# EAGLE schematic PinHeck (EAGLE 7.4.0), part 1 of 2
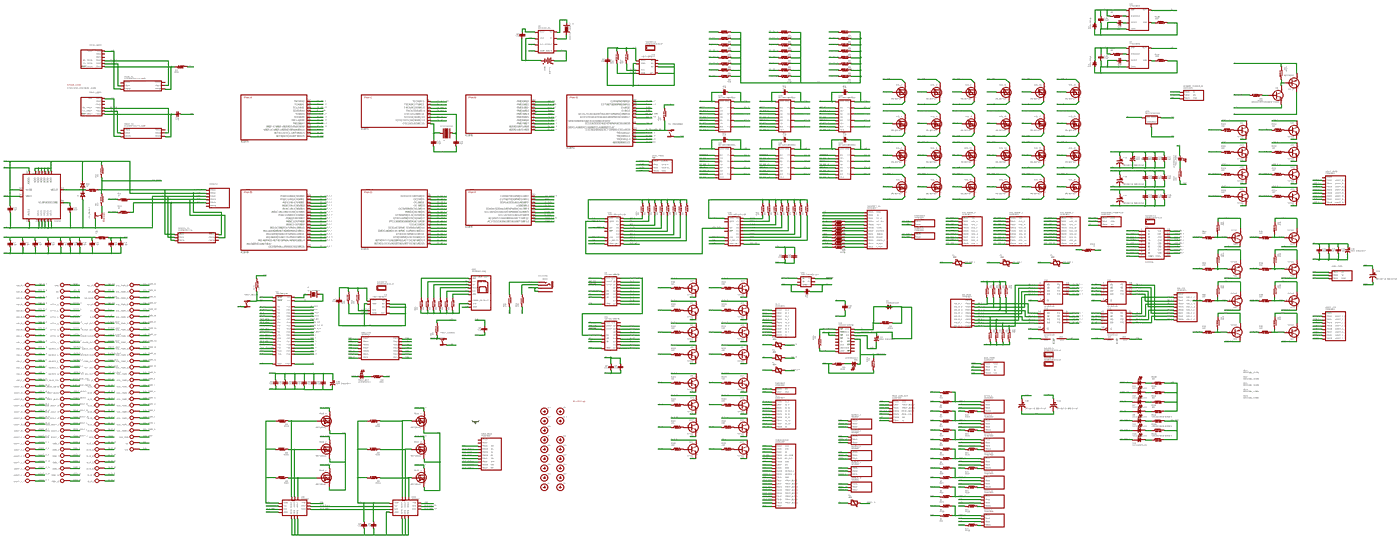
[diagram p0: schematic, sheet 1, overview]
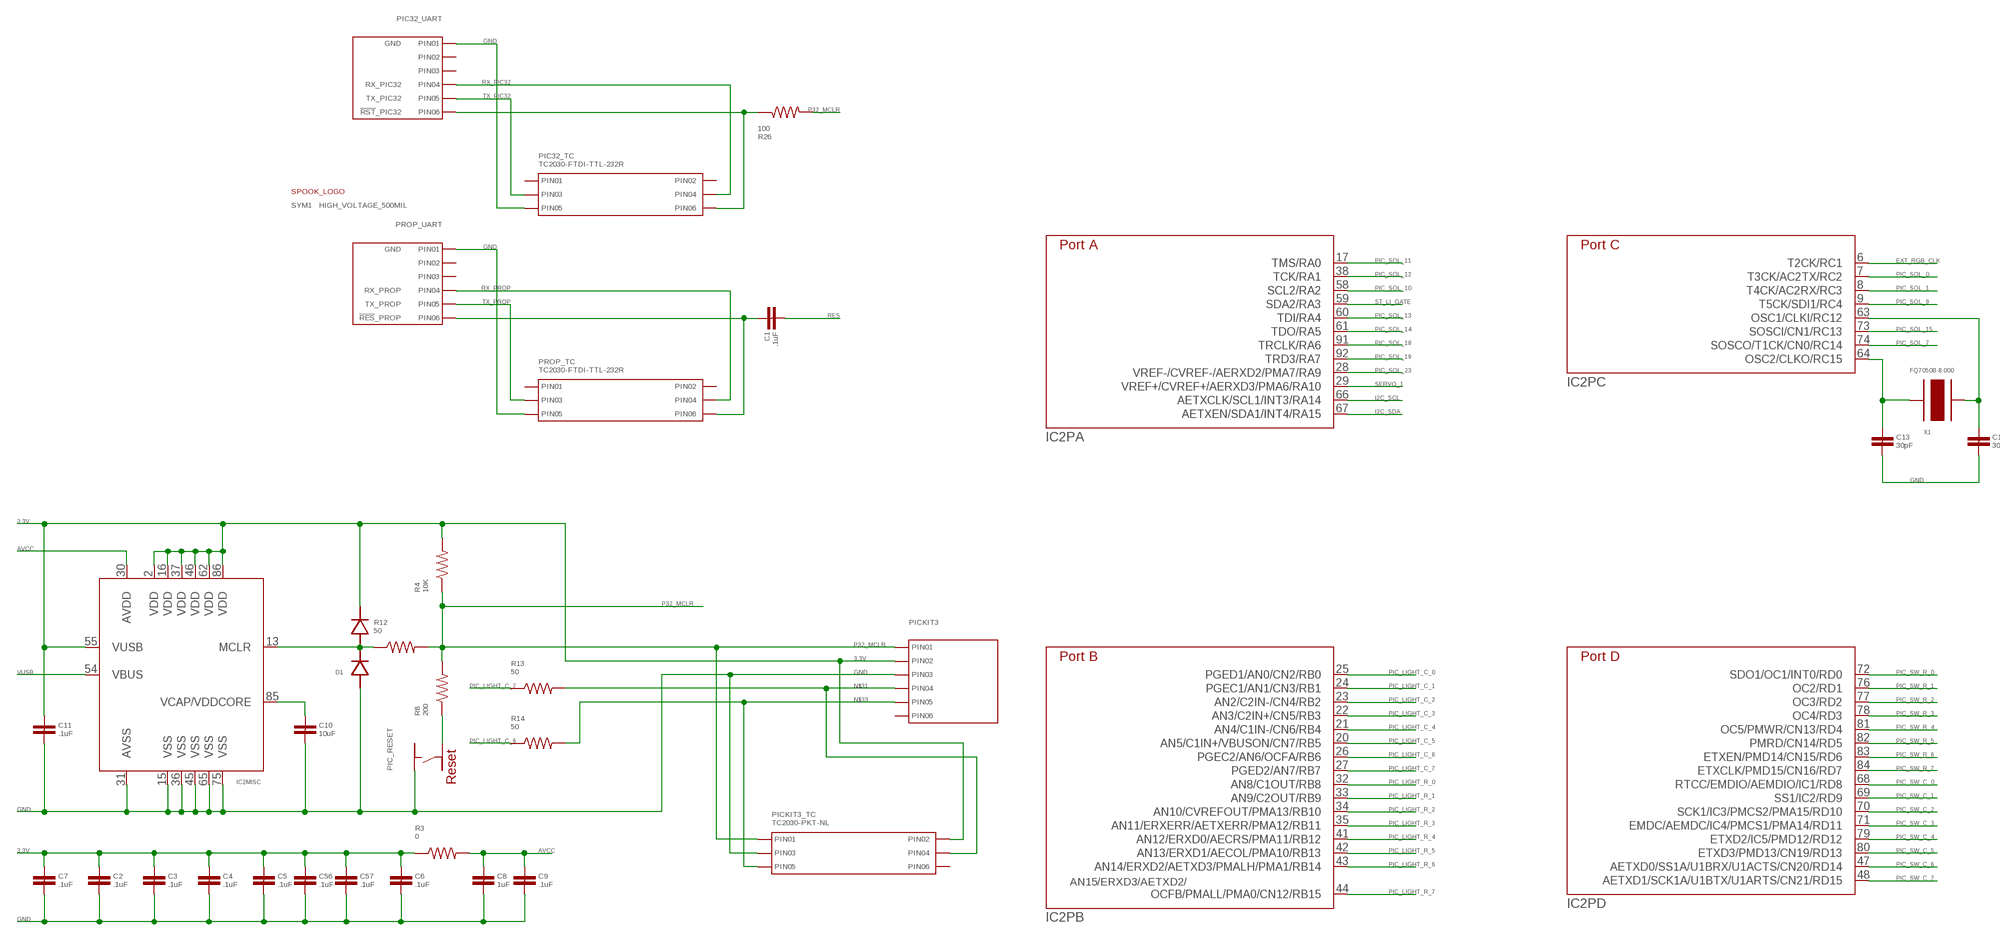
[diagram p1: schematic, sheet 1, part 1 of 7]
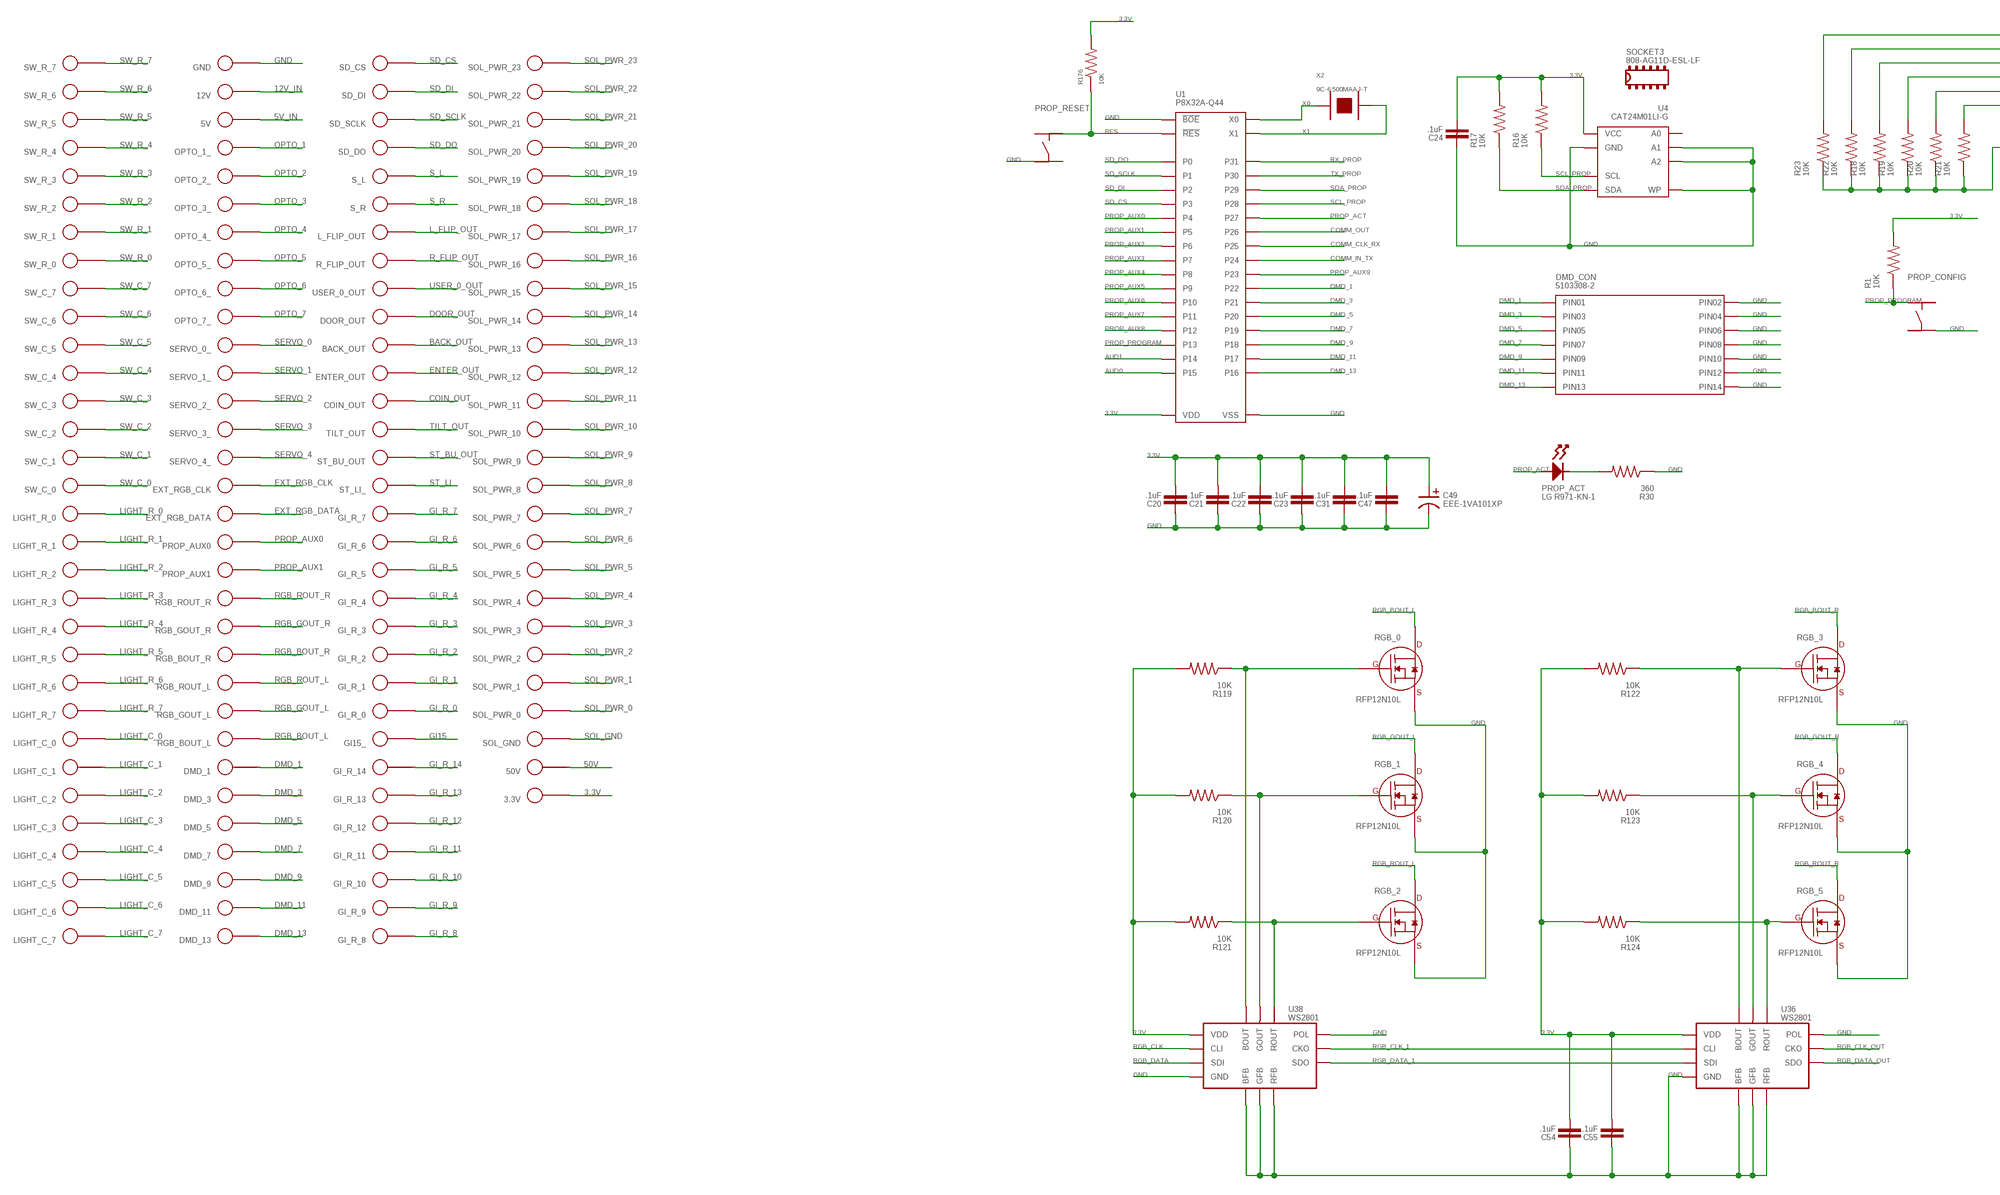
[diagram p2: schematic, sheet 1, part 2 of 7]
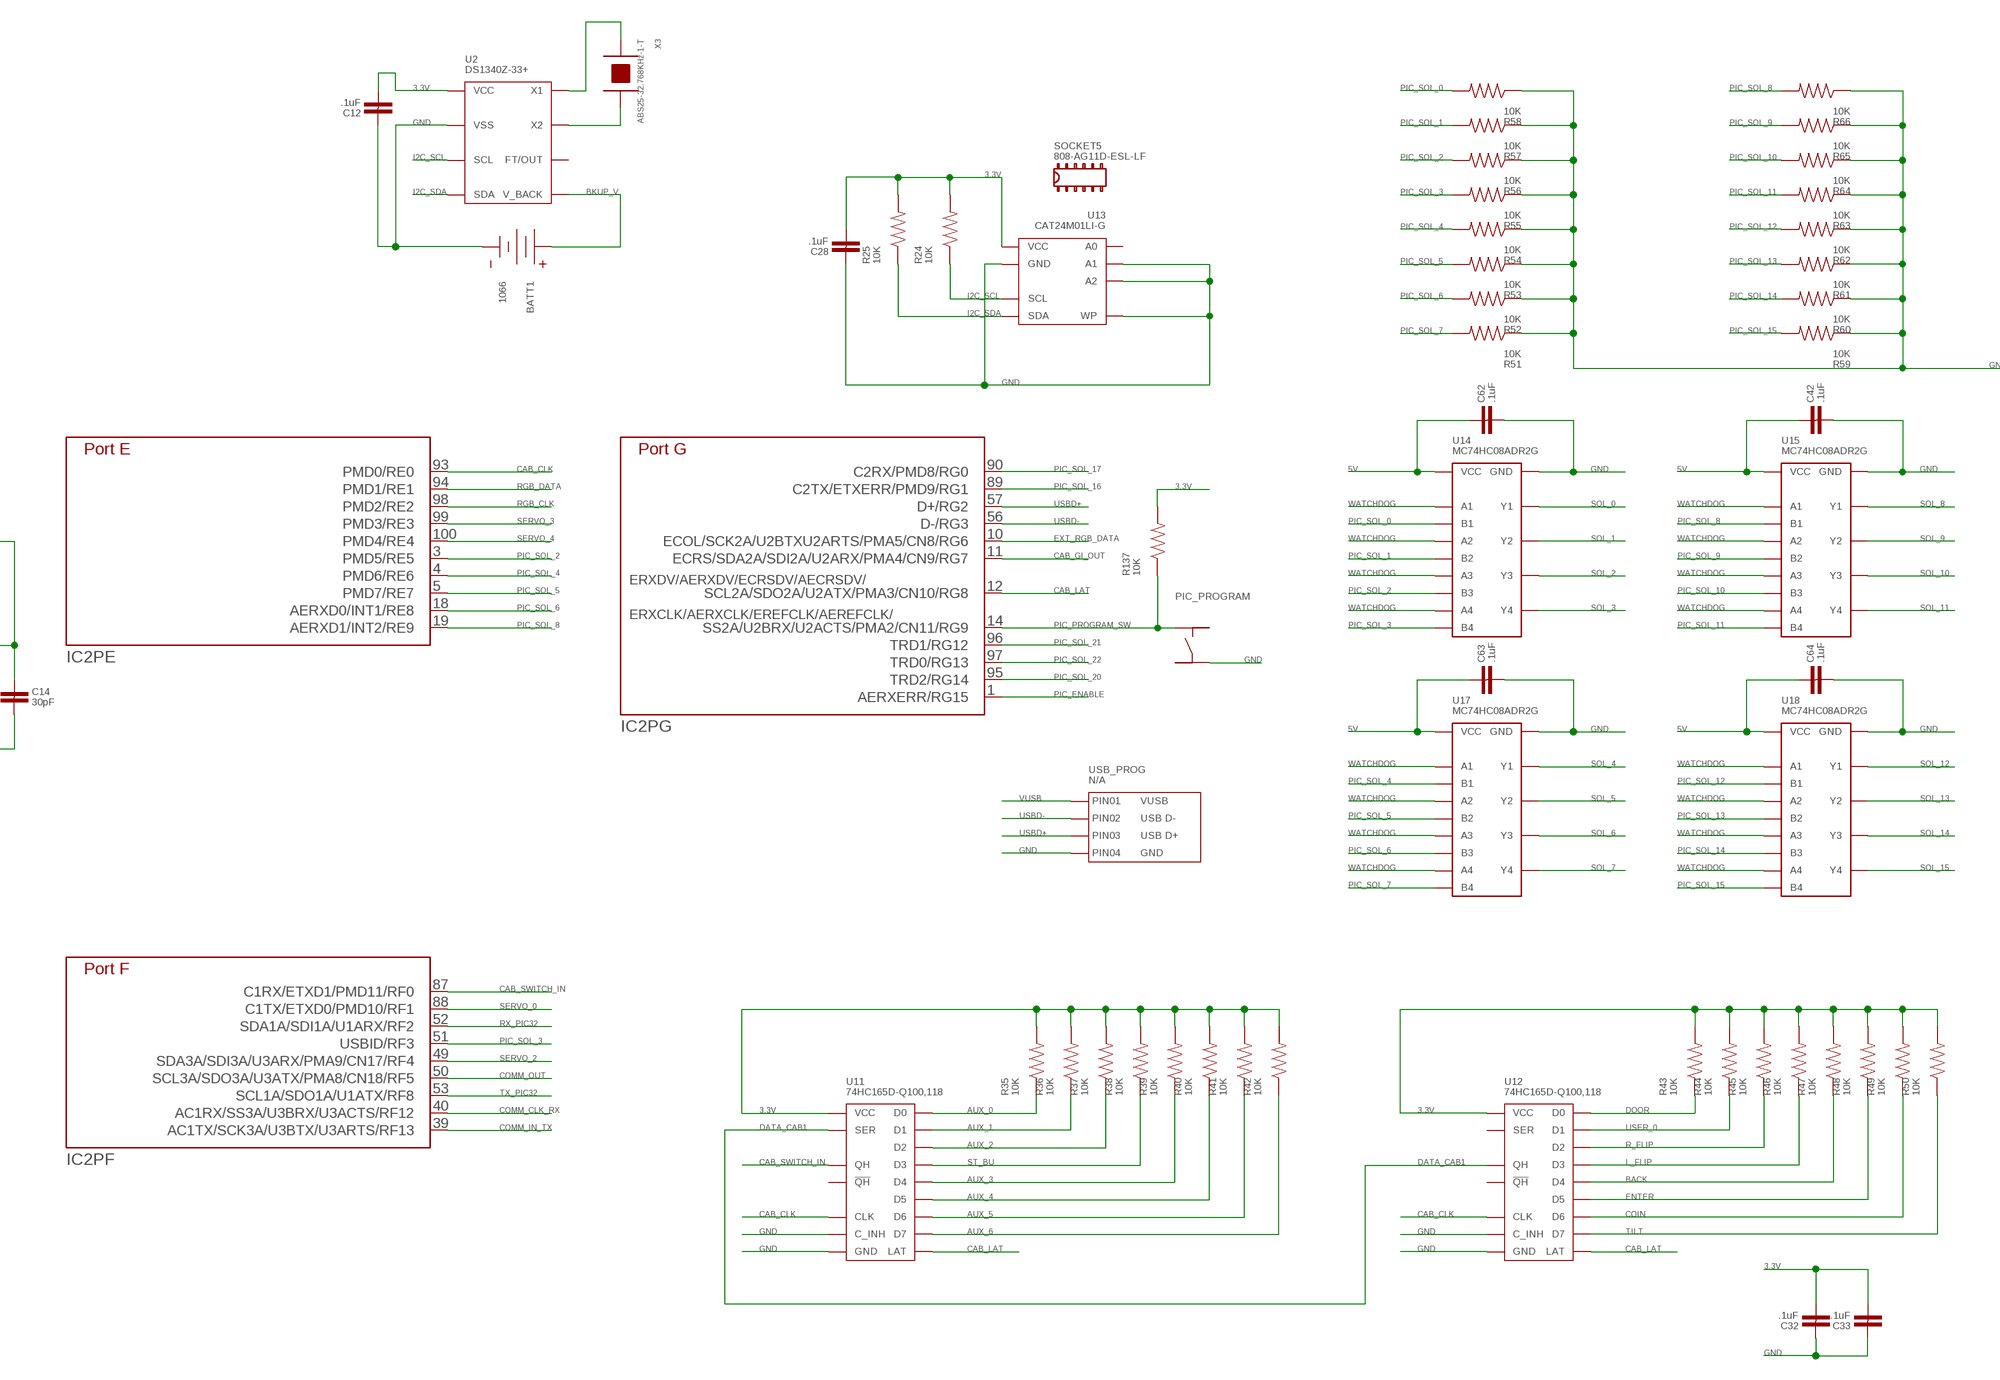
[diagram p3: schematic, sheet 1, part 3 of 7]
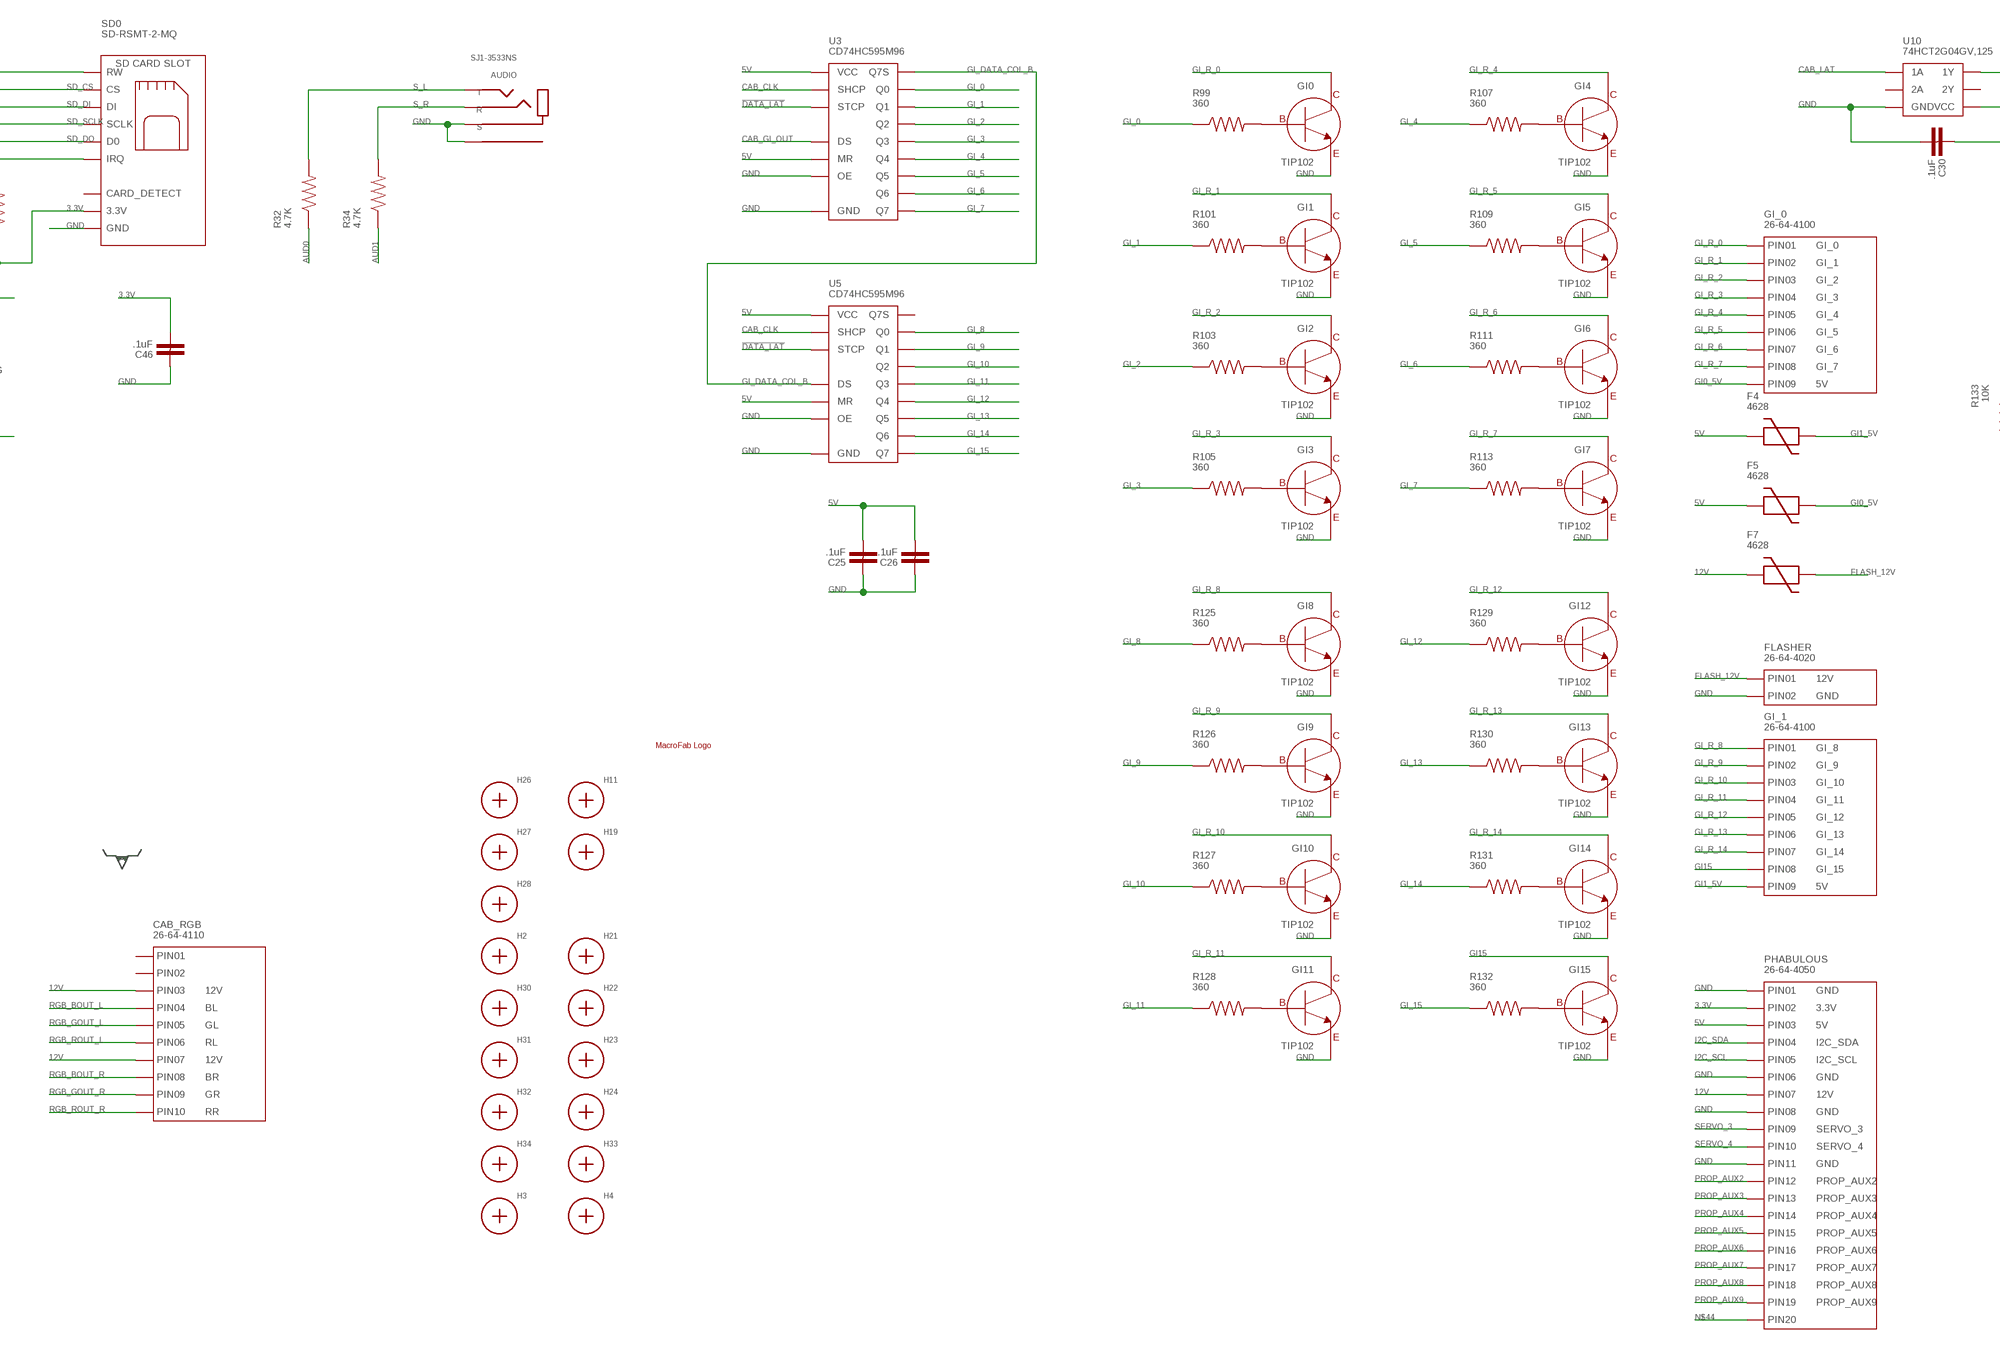
[diagram p4: schematic, sheet 1, part 4 of 7]
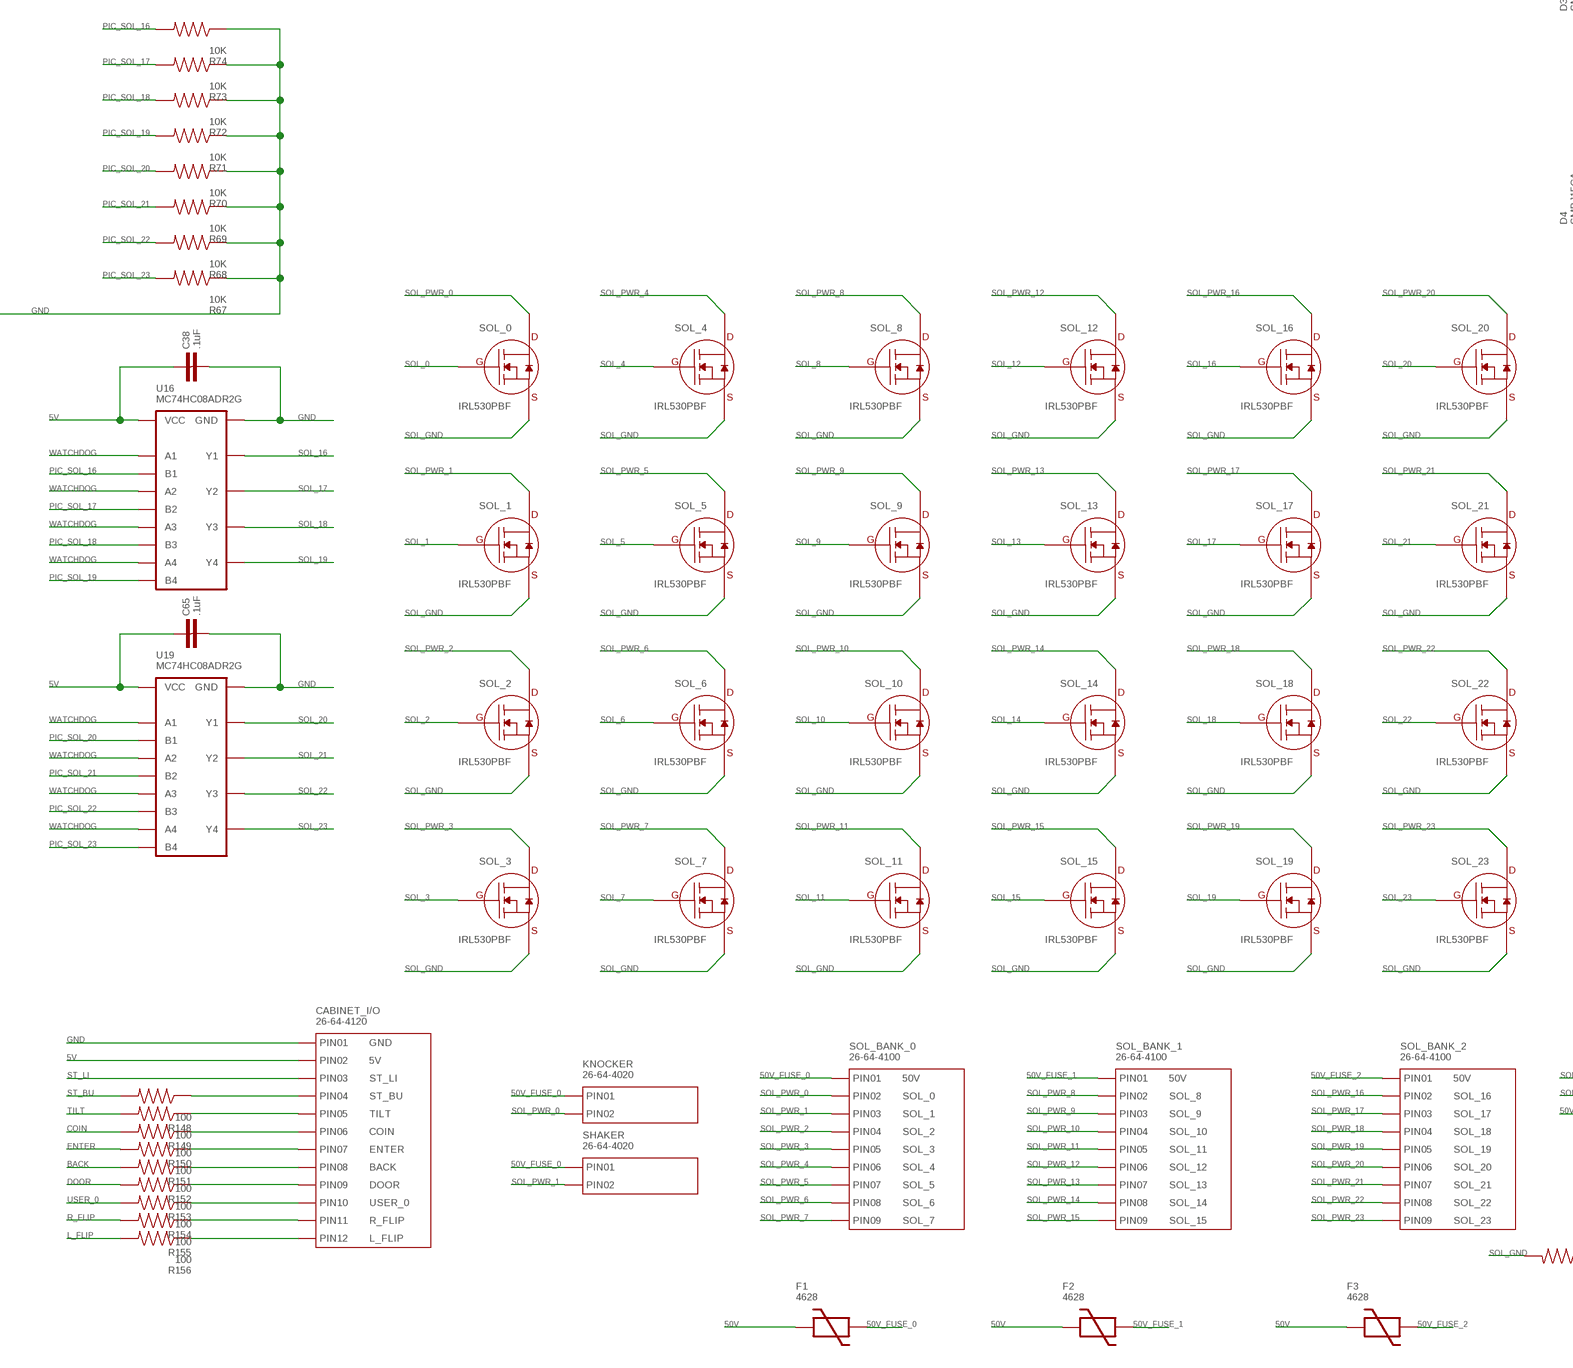
[diagram p5: schematic, sheet 1, part 5 of 7]
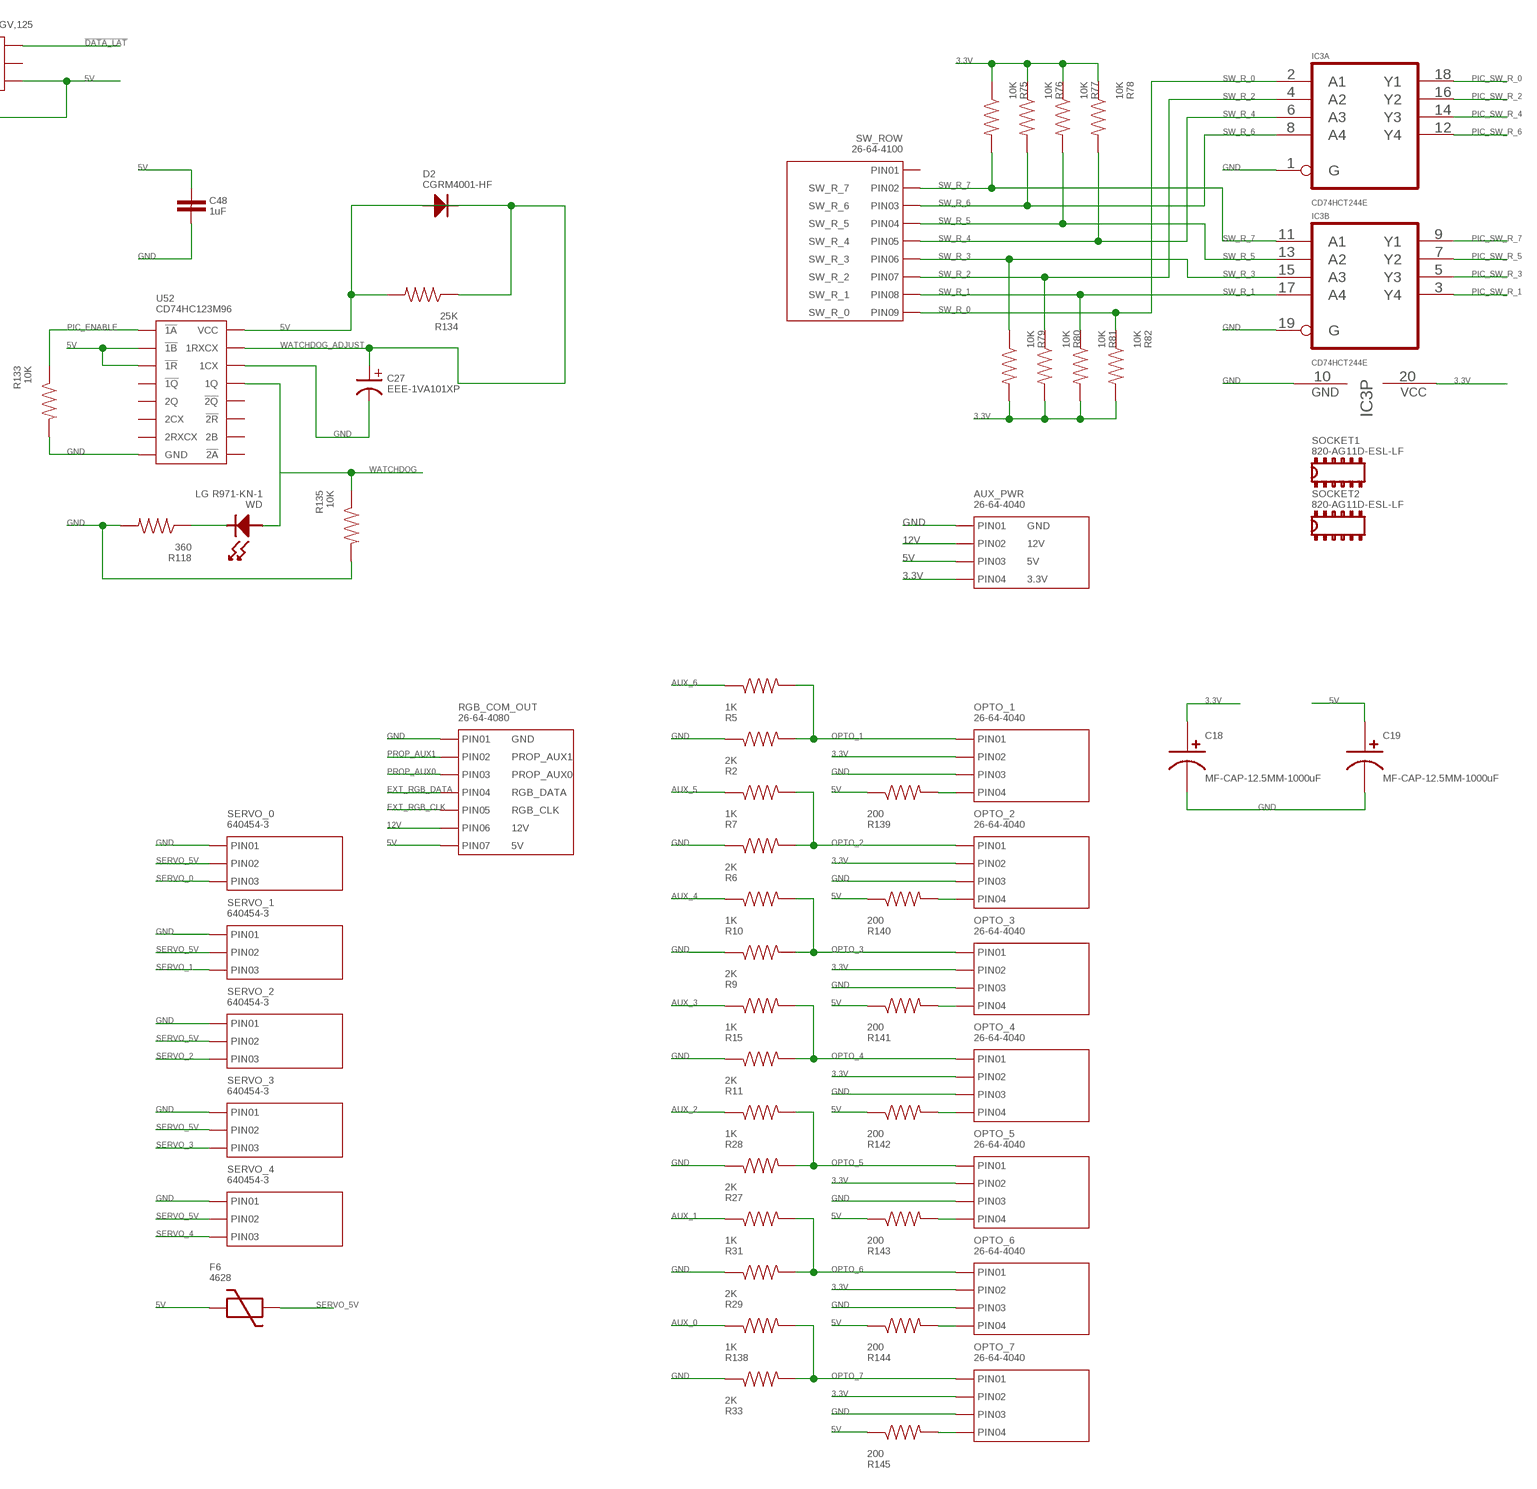
[diagram p6: schematic, sheet 1, part 6 of 7]
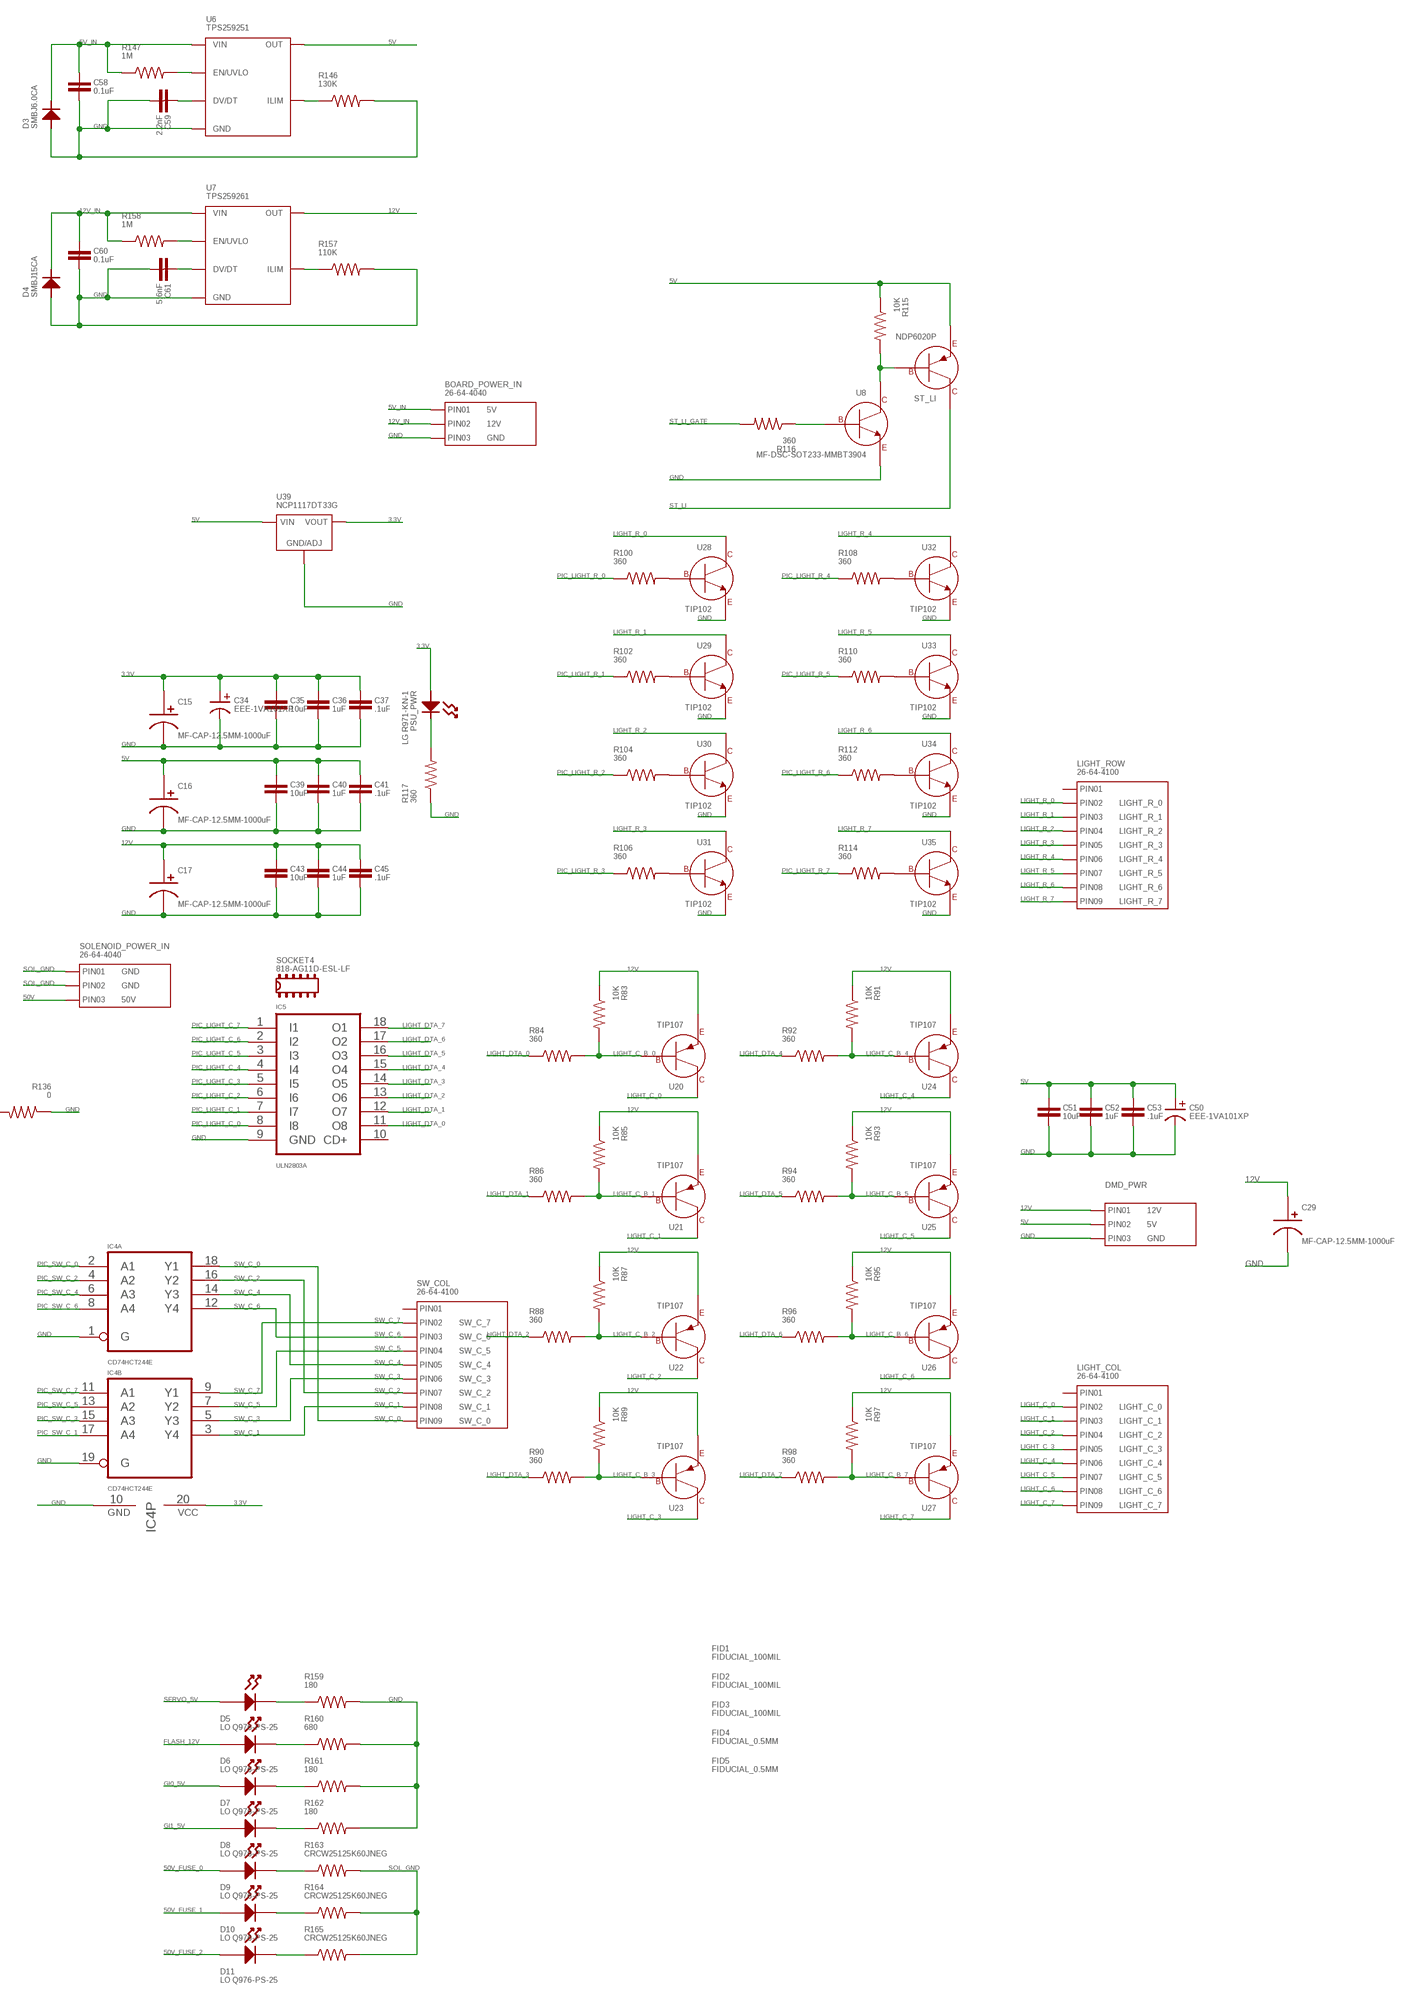
[diagram p7: schematic, sheet 1, part 7 of 7]

## Parts
3.3V  TEST_POINT_SINGLE_ROUND_100MIL  [100MIL_TP]
5V  TEST_POINT_SINGLE_ROUND_100MIL  [100MIL_TP]
12V  TEST_POINT_SINGLE_ROUND_100MIL  [100MIL_TP]
50V  TEST_POINT_SINGLE_ROUND_100MIL  [100MIL_TP]
AUDIO  SJ1-3533NS  TRS_SHIELD_JACK_SJ1-3533NS  [SJ1-3533NS]
AUX_PWR  26-64-4040  CON_01X04_26-64-4040  [26-64-4040]
BACK_OUT  TEST_POINT_SINGLE_ROUND_100MIL  [100MIL_TP]
BATT1  1066  BATTERY_1066  [1066]
BOARD_POWER_IN  26-64-4040  CON_01X03_26-64-4040_(KEYPIN2)  [26-64-4040(KEYPIN2)]
C1  .1uF  CAPACITOR_NON_POLAR_0805  [0805]
C2  .1uF  CAPACITOR_NON_POLAR_0805  [0805]
C3  .1uF  CAPACITOR_NON_POLAR_0805  [0805]
C4  .1uF  CAPACITOR_NON_POLAR_0805  [0805]
C5  .1uF  CAPACITOR_NON_POLAR_0805  [0805]
C6  .1uF  CAPACITOR_NON_POLAR_0805  [0805]
C7  .1uF  CAPACITOR_NON_POLAR_0805  [0805]
C8  1uF  CAPACITOR_NON_POLAR_0805  [0805]
C9  .1uF  CAPACITOR_NON_POLAR_0805  [0805]
C10  10uF  CAPACITOR_NON_POLAR_1206  [1206]
C11  .1uF  CAPACITOR_NON_POLAR_0805  [0805]
C12  .1uF  CAPACITOR_NON_POLAR_0805  [0805]
C13  30pF  CAPACITOR_NON_POLAR_0805  [0805]
C14  30pF  CAPACITOR_NON_POLAR_0805  [0805]
C15  MF-CAP-12.5MM-1000uF  CAPACITOR_P_12.5MM  [CP12.5MM]
C16  MF-CAP-12.5MM-1000uF  CAPACITOR_P_12.5MM  [CP12.5MM]
C17  MF-CAP-12.5MM-1000uF  CAPACITOR_P_12.5MM  [CP12.5MM]
C18  MF-CAP-12.5MM-1000uF  CAPACITOR_P_12.5MM  [CP12.5MM]
C19  MF-CAP-12.5MM-1000uF  CAPACITOR_P_12.5MM  [CP12.5MM]
C20  .1uF  CAPACITOR_NON_POLAR_0805  [0805]
C21  .1uF  CAPACITOR_NON_POLAR_0805  [0805]
C22  .1uF  CAPACITOR_NON_POLAR_0805  [0805]
C23  .1uF  CAPACITOR_NON_POLAR_0805  [0805]
C24  .1uF  CAPACITOR_NON_POLAR_0805  [0805]
C25  .1uF  CAPACITOR_NON_POLAR_0805  [0805]
C26  .1uF  CAPACITOR_NON_POLAR_0805  [0805]
C27  EEE-1VA101XP  CAPACITOR_POLARIZED_6.3MM_SMD  [6.3MM_CAP_SMD]
C28  .1uF  CAPACITOR_NON_POLAR_0805  [0805]
C29  MF-CAP-12.5MM-1000uF  CAPACITOR_P_6.3MM  [CP6.3MM]
C30  .1uF  CAPACITOR_NON_POLAR_0805  [0805]
C31  .1uF  CAPACITOR_NON_POLAR_0805  [0805]
C32  .1uF  CAPACITOR_NON_POLAR_0805  [0805]
C33  .1uF  CAPACITOR_NON_POLAR_0805  [0805]
C34  EEE-1VA101XP  CAPACITOR_POLARIZED_6.3MM_SMD  [6.3MM_CAP_SMD]
C35  10uF  CAPACITOR_NON_POLAR_1206  [1206]
C36  1uF  CAPACITOR_NON_POLAR_0805  [0805]
C37  .1uF  CAPACITOR_NON_POLAR_0805  [0805]
C38  .1uF  CAPACITOR_NON_POLAR_0805  [0805]
C39  10uF  CAPACITOR_NON_POLAR_1206  [1206]
C40  1uF  CAPACITOR_NON_POLAR_0805  [0805]
C41  .1uF  CAPACITOR_NON_POLAR_0805  [0805]
C42  .1uF  CAPACITOR_NON_POLAR_0805  [0805]
C43  10uF  CAPACITOR_NON_POLAR_1206  [1206]
C44  1uF  CAPACITOR_NON_POLAR_0805  [0805]
C45  .1uF  CAPACITOR_NON_POLAR_0805  [0805]
C46  .1uF  CAPACITOR_NON_POLAR_0805  [0805]
C47  .1uF  CAPACITOR_NON_POLAR_0805  [0805]
C48  1uF  CAPACITOR_NON_POLAR_0805  [0805]
C49  EEE-1VA101XP  CAPACITOR_POLARIZED_6.3MM_SMD  [6.3MM_CAP_SMD]
C50  EEE-1VA101XP  CAPACITOR_POLARIZED_6.3MM_SMD  [6.3MM_CAP_SMD]
C51  10uF  CAPACITOR_NON_POLAR_1206  [1206]
C52  1uF  CAPACITOR_NON_POLAR_0805  [0805]
C53  .1uF  CAPACITOR_NON_POLAR_0805  [0805]
C54  .1uF  CAPACITOR_NON_POLAR_0805  [0805]
C55  .1uF  CAPACITOR_NON_POLAR_0805  [0805]
C56  .1uF  CAPACITOR_NON_POLAR_0805  [0805]
C57  .1uF  CAPACITOR_NON_POLAR_0805  [0805]
C58  0.1uF  CAPACITOR_NON_POLAR_0805  [0805]
C59  2.2nF  CAPACITOR_NON_POLAR_0805  [0805]
C60  0.1uF  CAPACITOR_NON_POLAR_0805  [0805]
C61  5.6nF  CAPACITOR_NON_POLAR_0805  [0805]
C62  .1uF  CAPACITOR_NON_POLAR_0805  [0805]
C63  .1uF  CAPACITOR_NON_POLAR_0805  [0805]
C64  .1uF  CAPACITOR_NON_POLAR_0805  [0805]
C65  .1uF  CAPACITOR_NON_POLAR_0805  [0805]
CAB_RGB  26-64-4110  CON_01X10_26-64-4110(KEYPIN3)  [26-64-4110(KEYPIN3)]
CABINET_I/O  26-64-4120  CON_01X12_26-64-4120  [26-64-4120]
COIN_OUT  TEST_POINT_SINGLE_ROUND_100MIL  [100MIL_TP]
D1  BAV99W,115  BAV99W  [SOT-323]
D2  CGRM4001-HF  DIODE_SOD-123  [SOD-123]
D3  SMBJ6.0CA  DIODE_SMBJ  [SMBJ]
D4  SMBJ15CA  DIODE_SMBJ  [SMBJ]
D5  LO Q976-PS-25  LED_SINGLE_0603  [LED0603]
D6  LO Q976-PS-25  LED_SINGLE_0603  [LED0603]
D7  LO Q976-PS-25  LED_SINGLE_0603  [LED0603]
D8  LO Q976-PS-25  LED_SINGLE_0603  [LED0603]
D9  LO Q976-PS-25  LED_SINGLE_0603  [LED0603]
D10  LO Q976-PS-25  LED_SINGLE_0603  [LED0603]
D11  LO Q976-PS-25  LED_SINGLE_0603  [LED0603]
DMD_1  TEST_POINT_SINGLE_ROUND_100MIL  [100MIL_TP]
DMD_3  TEST_POINT_SINGLE_ROUND_100MIL  [100MIL_TP]
DMD_5  TEST_POINT_SINGLE_ROUND_100MIL  [100MIL_TP]
DMD_7  TEST_POINT_SINGLE_ROUND_100MIL  [100MIL_TP]
DMD_9  TEST_POINT_SINGLE_ROUND_100MIL  [100MIL_TP]
DMD_11  TEST_POINT_SINGLE_ROUND_100MIL  [100MIL_TP]
DMD_13  TEST_POINT_SINGLE_ROUND_100MIL  [100MIL_TP]
DMD_CON  5103308-2  CON_02X07_5103308-2  [5103308-2]
DMD_PWR  CON_01X03_26-64-4040_(KEYPIN1)  [26-64-4040(KEYPIN1)]
DOOR_OUT  TEST_POINT_SINGLE_ROUND_100MIL  [100MIL_TP]
ENTER_OUT  TEST_POINT_SINGLE_ROUND_100MIL  [100MIL_TP]
EXT_RGB_CLK  TEST_POINT_SINGLE_ROUND_100MIL  [100MIL_TP]
EXT_RGB_DATA  TEST_POINT_SINGLE_ROUND_100MIL  [100MIL_TP]
F1  4628  PTC_FUSE_4628  [4628]
F2  4628  PTC_FUSE_4628  [4628]
F3  4628  PTC_FUSE_4628  [4628]
F4  4628  PTC_FUSE_4628  [4628]
F5  4628  PTC_FUSE_4628  [4628]
F6  4628  PTC_FUSE_4628  [4628]
F7  4628  PTC_FUSE_4628  [4628]
FID1  FIDUCIAL_100MIL  [FIDUCIAL_100MIL]
FID2  FIDUCIAL_100MIL  [FIDUCIAL_100MIL]
FID3  FIDUCIAL_100MIL  [FIDUCIAL_100MIL]
FID4  FIDUCIAL_0.5MM  [FIDUCIAL_0.5MM]
FID5  FIDUCIAL_0.5MM  [FIDUCIAL_0.5MM]
FLASHER  26-64-4020  CON_01X02_26-64-4020  [26-64-4020]
GI0  TIP102  BJT_NPN_SINGLE_TO-220  [TO-220AB]
GI1  TIP102  BJT_NPN_SINGLE_TO-220  [TO-220AB]
GI2  TIP102  BJT_NPN_SINGLE_TO-220  [TO-220AB]
GI3  TIP102  BJT_NPN_SINGLE_TO-220  [TO-220AB]
GI4  TIP102  BJT_NPN_SINGLE_TO-220  [TO-220AB]
GI5  TIP102  BJT_NPN_SINGLE_TO-220  [TO-220AB]
GI6  TIP102  BJT_NPN_SINGLE_TO-220  [TO-220AB]
GI7  TIP102  BJT_NPN_SINGLE_TO-220  [TO-220AB]
GI8  TIP102  BJT_NPN_SINGLE_TO-220  [TO-220AB]
GI9  TIP102  BJT_NPN_SINGLE_TO-220  [TO-220AB]
GI10  TIP102  BJT_NPN_SINGLE_TO-220  [TO-220AB]
GI11  TIP102  BJT_NPN_SINGLE_TO-220  [TO-220AB]
GI12  TIP102  BJT_NPN_SINGLE_TO-220  [TO-220AB]
GI13  TIP102  BJT_NPN_SINGLE_TO-220  [TO-220AB]
GI14  TIP102  BJT_NPN_SINGLE_TO-220  [TO-220AB]
GI15  TIP102  BJT_NPN_SINGLE_TO-220  [TO-220AB]
GI15_  TEST_POINT_SINGLE_ROUND_100MIL  [100MIL_TP]
GI_0  26-64-4100  CON_01X09_26-64-4100_(KEYPIN9)  [26-64-4100(KEYPIN9)]
GI_1  26-64-4100  CON_01X09_26-64-4100_(KEYPIN10)  [26-64-4100(KEYPIN10)]
GI_R_0  TEST_POINT_SINGLE_ROUND_100MIL  [100MIL_TP]
GI_R_1  TEST_POINT_SINGLE_ROUND_100MIL  [100MIL_TP]
GI_R_2  TEST_POINT_SINGLE_ROUND_100MIL  [100MIL_TP]
GI_R_3  TEST_POINT_SINGLE_ROUND_100MIL  [100MIL_TP]
GI_R_4  TEST_POINT_SINGLE_ROUND_100MIL  [100MIL_TP]
GI_R_5  TEST_POINT_SINGLE_ROUND_100MIL  [100MIL_TP]
GI_R_6  TEST_POINT_SINGLE_ROUND_100MIL  [100MIL_TP]
GI_R_7  TEST_POINT_SINGLE_ROUND_100MIL  [100MIL_TP]
GI_R_8  TEST_POINT_SINGLE_ROUND_100MIL  [100MIL_TP]
GI_R_9  TEST_POINT_SINGLE_ROUND_100MIL  [100MIL_TP]
GI_R_10  TEST_POINT_SINGLE_ROUND_100MIL  [100MIL_TP]
GI_R_11  TEST_POINT_SINGLE_ROUND_100MIL  [100MIL_TP]
GI_R_12  TEST_POINT_SINGLE_ROUND_100MIL  [100MIL_TP]
GI_R_13  TEST_POINT_SINGLE_ROUND_100MIL  [100MIL_TP]
GI_R_14  TEST_POINT_SINGLE_ROUND_100MIL  [100MIL_TP]
GND  TEST_POINT_SINGLE_ROUND_100MIL  [100MIL_TP]
H2  MOUNT_HOLE150MIL  [MOUNT_HOLE_150MIL]
H3  MOUNT_HOLE150MIL  [MOUNT_HOLE_150MIL]
H4  MOUNT_HOLE150MIL  [MOUNT_HOLE_150MIL]
H11  MOUNT_HOLE150MIL  [MOUNT_HOLE_150MIL]
H19  MOUNT_HOLE150MIL  [MOUNT_HOLE_150MIL]
H21  MOUNT_HOLE150MIL  [MOUNT_HOLE_150MIL]
H22  MOUNT_HOLE150MIL  [MOUNT_HOLE_150MIL]
H23  MOUNT_HOLE150MIL  [MOUNT_HOLE_150MIL]
H24  MOUNT_HOLE150MIL  [MOUNT_HOLE_150MIL]
H26  MOUNT_HOLE150MIL  [MOUNT_HOLE_150MIL]
H27  MOUNT_HOLE150MIL  [MOUNT_HOLE_150MIL]
H28  MOUNT_HOLE150MIL  [MOUNT_HOLE_150MIL]
H30  MOUNT_HOLE150MIL  [MOUNT_HOLE_150MIL]
H31  MOUNT_HOLE150MIL  [MOUNT_HOLE_150MIL]
H32  MOUNT_HOLE150MIL  [MOUNT_HOLE_150MIL]
H33  MOUNT_HOLE150MIL  [MOUNT_HOLE_150MIL]
H34  MOUNT_HOLE150MIL  [MOUNT_HOLE_150MIL]
IC2  PIC32MX795F512L-80I/PT  PIC32MX7X5FL-PT  [TQ100-PT]
IC3  CD74HCT244E  74LS244N  [DIL20]
IC4  CD74HCT244E  74LS244N  [DIL20]
IC5  ULN2803A  [DIL18]
KNOCKER  26-64-4020  CON_01X02_26-64-4020  [26-64-4020]
L_FLIP_OUT  TEST_POINT_SINGLE_ROUND_100MIL  [100MIL_TP]
LIGHT_C_0  TEST_POINT_SINGLE_ROUND_100MIL  [100MIL_TP]
LIGHT_C_1  TEST_POINT_SINGLE_ROUND_100MIL  [100MIL_TP]
LIGHT_C_2  TEST_POINT_SINGLE_ROUND_100MIL  [100MIL_TP]
LIGHT_C_3  TEST_POINT_SINGLE_ROUND_100MIL  [100MIL_TP]
LIGHT_C_4  TEST_POINT_SINGLE_ROUND_100MIL  [100MIL_TP]
LIGHT_C_5  TEST_POINT_SINGLE_ROUND_100MIL  [100MIL_TP]
LIGHT_C_6  TEST_POINT_SINGLE_ROUND_100MIL  [100MIL_TP]
LIGHT_C_7  TEST_POINT_SINGLE_ROUND_100MIL  [100MIL_TP]
LIGHT_COL  26-64-4100  CON_01X09_26-64-4100_(KEYPIN2)  [26-64-4100(KEYPIN2)]
LIGHT_R_0  TEST_POINT_SINGLE_ROUND_100MIL  [100MIL_TP]
LIGHT_R_1  TEST_POINT_SINGLE_ROUND_100MIL  [100MIL_TP]
LIGHT_R_2  TEST_POINT_SINGLE_ROUND_100MIL  [100MIL_TP]
LIGHT_R_3  TEST_POINT_SINGLE_ROUND_100MIL  [100MIL_TP]
LIGHT_R_4  TEST_POINT_SINGLE_ROUND_100MIL  [100MIL_TP]
LIGHT_R_5  TEST_POINT_SINGLE_ROUND_100MIL  [100MIL_TP]
LIGHT_R_6  TEST_POINT_SINGLE_ROUND_100MIL  [100MIL_TP]
LIGHT_R_7  TEST_POINT_SINGLE_ROUND_100MIL  [100MIL_TP]
LIGHT_ROW  26-64-4100  CON_01X09_26-64-4100_(KEYPIN3)  [26-64-4100(KEYPIN3)]
LOGO1  SPOOKY_LOGOSPOOKY_LOGO  [SPOOKY_LOGO]
OPTO_1  26-64-4040  CON_01X04_26-64-4040  [26-64-4040]
OPTO_1_  TEST_POINT_SINGLE_ROUND_100MIL  [100MIL_TP]
OPTO_2  26-64-4040  CON_01X04_26-64-4040  [26-64-4040]
OPTO_2_  TEST_POINT_SINGLE_ROUND_100MIL  [100MIL_TP]
OPTO_3  26-64-4040  CON_01X04_26-64-4040  [26-64-4040]
OPTO_3_  TEST_POINT_SINGLE_ROUND_100MIL  [100MIL_TP]
OPTO_4  26-64-4040  CON_01X04_26-64-4040  [26-64-4040]
OPTO_4_  TEST_POINT_SINGLE_ROUND_100MIL  [100MIL_TP]
OPTO_5  26-64-4040  CON_01X04_26-64-4040  [26-64-4040]
OPTO_5_  TEST_POINT_SINGLE_ROUND_100MIL  [100MIL_TP]
OPTO_6  26-64-4040  CON_01X04_26-64-4040  [26-64-4040]
OPTO_6_  TEST_POINT_SINGLE_ROUND_100MIL  [100MIL_TP]
OPTO_7  26-64-4040  CON_01X04_26-64-4040  [26-64-4040]
OPTO_7_  TEST_POINT_SINGLE_ROUND_100MIL  [100MIL_TP]
PHABULOUS  26-64-4050  CON_01X20_2.54MM_PIN_HEADER  [2.54MM_01X20_PIN_HEADER]
PIC32_TC  TC2030-FTDI-TTL-232R  CON_02X03_TC2030  [TC2030]
PIC32_UART  CON_01X06_2.54MM_PIN_HEADER  [2.54MM_01X06_PIN_HEADER]
PIC_PROGRAM  TACT_6MM  [TACT6MM]
PIC_RESET  TACT_6MM  [TACT6MM]
PICKIT3  CON_01X06_2.54MM_PIN_HEADER  [2.54MM_01X06_PIN_HEADER]
PICKIT3_TC  TC2030-PKT-NL  CON_02X03_TC2030  [TC2030]
PROP_ACT  LG R971-KN-1  LED_SINGLE_0805  [LED_0805]
PROP_AUX0  TEST_POINT_SINGLE_ROUND_100MIL  [100MIL_TP]
PROP_AUX1  TEST_POINT_SINGLE_ROUND_100MIL  [100MIL_TP]
PROP_CONFIG  TACT_6MM  [TACT6MM]
PROP_RESET  TACT_6MM  [TACT6MM]
PROP_TC  TC2030-FTDI-TTL-232R  CON_02X03_TC2030  [TC2030]
PROP_UART  CON_01X06_2.54MM_PIN_HEADER  [2.54MM_01X06_PIN_HEADER]
PSU_PWR  LG R971-KN-1  LED_SINGLE_0805  [LED_0805]
R1  10K  RESISTOR_0805  [0805]
R2  2K  RESISTOR_0805  [0805]
R3  0  RESISTOR_0805  [0805]
R4  10K  RESISTOR_0805  [0805]
R5  1K  RESISTOR_0805  [0805]
R6  2K  RESISTOR_0805  [0805]
R7  1K  RESISTOR_0805  [0805]
R8  200  RESISTOR_0805  [0805]
R9  2K  RESISTOR_0805  [0805]
R10  1K  RESISTOR_0805  [0805]
R11  2K  RESISTOR_0805  [0805]
R12  50  RESISTOR_0805  [0805]
R13  50  RESISTOR_0805  [0805]
R14  50  RESISTOR_0805  [0805]
R15  1K  RESISTOR_0805  [0805]
R16  10K  RESISTOR_0805  [0805]
R17  10K  RESISTOR_0805  [0805]
R18  10K  RESISTOR_0805  [0805]
R19  10K  RESISTOR_0805  [0805]
R20  10K  RESISTOR_0805  [0805]
R21  10K  RESISTOR_0805  [0805]
R22  10K  RESISTOR_0805  [0805]
R23  10K  RESISTOR_0805  [0805]
R24  10K  RESISTOR_0805  [0805]
R25  10K  RESISTOR_0805  [0805]
R26  100  RESISTOR_0805  [0805]
R27  2K  RESISTOR_0805  [0805]
R28  1K  RESISTOR_0805  [0805]
R29  2K  RESISTOR_0805  [0805]
R30  360  RESISTOR_0805  [0805]
R31  1K  RESISTOR_0805  [0805]
R32  4.7K  RESISTOR_0805  [0805]
R33  2K  RESISTOR_0805  [0805]
R34  4.7K  RESISTOR_0805  [0805]
R35  10K  RESISTOR_0805  [0805]
R36  10K  RESISTOR_0805  [0805]
R37  10K  RESISTOR_0805  [0805]
R38  10K  RESISTOR_0805  [0805]
R39  10K  RESISTOR_0805  [0805]
R40  10K  RESISTOR_0805  [0805]
R41  10K  RESISTOR_0805  [0805]
R42  10K  RESISTOR_0805  [0805]
R43  10K  RESISTOR_0805  [0805]
R44  10K  RESISTOR_0805  [0805]
R45  10K  RESISTOR_0805  [0805]
R46  10K  RESISTOR_0805  [0805]
R47  10K  RESISTOR_0805  [0805]
R48  10K  RESISTOR_0805  [0805]
R49  10K  RESISTOR_0805  [0805]
R50  10K  RESISTOR_0805  [0805]
R51  10K  RESISTOR_0805  [0805]
R52  10K  RESISTOR_0805  [0805]
R53  10K  RESISTOR_0805  [0805]
R54  10K  RESISTOR_0805  [0805]
R55  10K  RESISTOR_0805  [0805]
R56  10K  RESISTOR_0805  [0805]
R57  10K  RESISTOR_0805  [0805]
R58  10K  RESISTOR_0805  [0805]
R59  10K  RESISTOR_0805  [0805]
R60  10K  RESISTOR_0805  [0805]
R61  10K  RESISTOR_0805  [0805]
R62  10K  RESISTOR_0805  [0805]
R63  10K  RESISTOR_0805  [0805]
R64  10K  RESISTOR_0805  [0805]
R65  10K  RESISTOR_0805  [0805]
R66  10K  RESISTOR_0805  [0805]
R67  10K  RESISTOR_0805  [0805]
R68  10K  RESISTOR_0805  [0805]
R69  10K  RESISTOR_0805  [0805]
R70  10K  RESISTOR_0805  [0805]
R71  10K  RESISTOR_0805  [0805]
R72  10K  RESISTOR_0805  [0805]
R73  10K  RESISTOR_0805  [0805]
R74  10K  RESISTOR_0805  [0805]
R75  10K  RESISTOR_0805  [0805]
R76  10K  RESISTOR_0805  [0805]
R77  10K  RESISTOR_0805  [0805]
R78  10K  RESISTOR_0805  [0805]
R79  10K  RESISTOR_0805  [0805]
R80  10K  RESISTOR_0805  [0805]
R81  10K  RESISTOR_0805  [0805]
R82  10K  RESISTOR_0805  [0805]
R83  10K  RESISTOR_0805  [0805]
R84  360  RESISTOR_0805  [0805]
R85  10K  RESISTOR_0805  [0805]
R86  360  RESISTOR_0805  [0805]
R87  10K  RESISTOR_0805  [0805]
R88  360  RESISTOR_0805  [0805]
R89  10K  RESISTOR_0805  [0805]
R90  360  RESISTOR_0805  [0805]
R91  10K  RESISTOR_0805  [0805]
R92  360  RESISTOR_0805  [0805]
R93  10K  RESISTOR_0805  [0805]
R94  360  RESISTOR_0805  [0805]
R95  10K  RESISTOR_0805  [0805]
R96  360  RESISTOR_0805  [0805]
R97  10K  RESISTOR_0805  [0805]
R98  360  RESISTOR_0805  [0805]
R99  360  RESISTOR_0805  [0805]
R100  360  RESISTOR_0805  [0805]
R101  360  RESISTOR_0805  [0805]
R102  360  RESISTOR_0805  [0805]
R103  360  RESISTOR_0805  [0805]
R104  360  RESISTOR_0805  [0805]
R105  360  RESISTOR_0805  [0805]
R106  360  RESISTOR_0805  [0805]
R107  360  RESISTOR_0805  [0805]
R108  360  RESISTOR_0805  [0805]
R109  360  RESISTOR_0805  [0805]
R110  360  RESISTOR_0805  [0805]
R111  360  RESISTOR_0805  [0805]
R112  360  RESISTOR_0805  [0805]
R113  360  RESISTOR_0805  [0805]
R114  360  RESISTOR_0805  [0805]
R115  10K  RESISTOR_0805  [0805]
R116  360  RESISTOR_0805  [0805]
R117  360  RESISTOR_0805  [0805]
R118  360  RESISTOR_0805  [0805]
R119  10K  RESISTOR_0805  [0805]
R120  10K  RESISTOR_0805  [0805]
R121  10K  RESISTOR_0805  [0805]
R122  10K  RESISTOR_0805  [0805]
R123  10K  RESISTOR_0805  [0805]
R124  10K  RESISTOR_0805  [0805]
R125  360  RESISTOR_0805  [0805]
R126  360  RESISTOR_0805  [0805]
R127  360  RESISTOR_0805  [0805]
R128  360  RESISTOR_0805  [0805]
R129  360  RESISTOR_0805  [0805]
R130  360  RESISTOR_0805  [0805]
R131  360  RESISTOR_0805  [0805]
R132  360  RESISTOR_0805  [0805]
R133  10K  RESISTOR_0805  [0805]
R134  25K  RESISTOR_0805  [0805]
R135  10K  RESISTOR_0805  [0805]
R136  0  RESISTOR_0805  [0805]
R137  10K  RESISTOR_0805  [0805]
R138  1K  RESISTOR_0805  [0805]
R139  200  RESISTOR_0805  [0805]
R140  200  RESISTOR_0805  [0805]
R141  200  RESISTOR_0805  [0805]
R142  200  RESISTOR_0805  [0805]
R143  200  RESISTOR_0805  [0805]
R144  200  RESISTOR_0805  [0805]
R145  200  RESISTOR_0805  [0805]
R146  130K  RESISTOR_0805  [0805]
R147  1M  RESISTOR_0805  [0805]
R148  100  RESISTOR_0805  [0805]
R149  100  RESISTOR_0805  [0805]
R150  100  RESISTOR_0805  [0805]
R151  100  RESISTOR_0805  [0805]
R152  100  RESISTOR_0805  [0805]
R153  100  RESISTOR_0805  [0805]
R154  100  RESISTOR_0805  [0805]
R155  100  RESISTOR_0805  [0805]
R156  100  RESISTOR_0805  [0805]
R157  110K  RESISTOR_0805  [0805]
R158  1M  RESISTOR_0805  [0805]
R159  180  RESISTOR_0805  [0805]
R160  680  RESISTOR_0805  [0805]
R161  180  RESISTOR_0805  [0805]
R162  180  RESISTOR_0805  [0805]
R163  CRCW25125K60JNEG  RESISTOR_2512  [2512]
R164  CRCW25125K60JNEG  RESISTOR_2512  [2512]
R165  CRCW25125K60JNEG  RESISTOR_2512  [2512]
R176  10K  RESISTOR_0805  [0805]
R_FLIP_OUT  TEST_POINT_SINGLE_ROUND_100MIL  [100MIL_TP]
RGB_0  RFP12N10L  MOSFET_N-CHANNEL_SINGLE_TO-220AB  [TO-220AB]
RGB_1  RFP12N10L  MOSFET_N-CHANNEL_SINGLE_TO-220AB  [TO-220AB]
RGB_2  RFP12N10L  MOSFET_N-CHANNEL_SINGLE_TO-220AB  [TO-220AB]
RGB_3  RFP12N10L  MOSFET_N-CHANNEL_SINGLE_TO-220AB  [TO-220AB]
RGB_4  RFP12N10L  MOSFET_N-CHANNEL_SINGLE_TO-220AB  [TO-220AB]
RGB_5  RFP12N10L  MOSFET_N-CHANNEL_SINGLE_TO-220AB  [TO-220AB]
RGB_BOUT_L  TEST_POINT_SINGLE_ROUND_100MIL  [100MIL_TP]
RGB_BOUT_R  TEST_POINT_SINGLE_ROUND_100MIL  [100MIL_TP]
RGB_COM_OUT  26-64-4080  CON_01X07_26-64-4080(KEYPIN2)  [26-64-4080(KEYPIN2)]
RGB_GOUT_L  TEST_POINT_SINGLE_ROUND_100MIL  [100MIL_TP]
RGB_GOUT_R  TEST_POINT_SINGLE_ROUND_100MIL  [100MIL_TP]
RGB_ROUT_L  TEST_POINT_SINGLE_ROUND_100MIL  [100MIL_TP]
RGB_ROUT_R  TEST_POINT_SINGLE_ROUND_100MIL  [100MIL_TP]
S_L  TEST_POINT_SINGLE_ROUND_100MIL  [100MIL_TP]
S_R  TEST_POINT_SINGLE_ROUND_100MIL  [100MIL_TP]
SD0  SD-RSMT-2-MQ  SD_CARD_SD-RSMT-2-MQ  [SD-RSMT-2-MQ]
SD_CS  TEST_POINT_SINGLE_ROUND_100MIL  [100MIL_TP]
SD_DI  TEST_POINT_SINGLE_ROUND_100MIL  [100MIL_TP]
SD_DO  TEST_POINT_SINGLE_ROUND_100MIL  [100MIL_TP]
SD_SCLK  TEST_POINT_SINGLE_ROUND_100MIL  [100MIL_TP]
SERVO_0  640454-3  CON_01X03_640454-3  [640454-3]
SERVO_0_  TEST_POINT_SINGLE_ROUND_100MIL  [100MIL_TP]
SERVO_1  640454-3  CON_01X03_640454-3  [640454-3]
SERVO_1_  TEST_POINT_SINGLE_ROUND_100MIL  [100MIL_TP]
SERVO_2  640454-3  CON_01X03_640454-3  [640454-3]
SERVO_2_  TEST_POINT_SINGLE_ROUND_100MIL  [100MIL_TP]
SERVO_3  640454-3  CON_01X03_640454-3  [640454-3]
SERVO_3_  TEST_POINT_SINGLE_ROUND_100MIL  [100MIL_TP]
SERVO_4  640454-3  CON_01X03_640454-3  [640454-3]
SERVO_4_  TEST_POINT_SINGLE_ROUND_100MIL  [100MIL_TP]
SHAKER  26-64-4020  CON_01X02_26-64-4020  [26-64-4020]
SOCKET1  820-AG11D-ESL-LF  DIP_SOCKET_20PIN  [20PIN_DIP_SOCKET]
SOCKET2  820-AG11D-ESL-LF  DIP_SOCKET_20PIN  [20PIN_DIP_SOCKET]
SOCKET3  808-AG11D-ESL-LF  DIP_SOCKET_8PIN  [8PIN_DIP_SOCKET]
SOCKET4  818-AG11D-ESL-LF  DIP_SOCKET_18PIN  [18PIN_DIP_SOCKET]
SOCKET5  808-AG11D-ESL-LF  DIP_SOCKET_8PIN  [8PIN_DIP_SOCKET]
SOL_0  IRL530PBF  MOSFET_N-CHANNEL_SINGLE_TO-220AB  [TO-220AB]
SOL_1  IRL530PBF  MOSFET_N-CHANNEL_SINGLE_TO-220AB  [TO-220AB]
SOL_2  IRL530PBF  MOSFET_N-CHANNEL_SINGLE_TO-220AB  [TO-220AB]
SOL_3  IRL530PBF  MOSFET_N-CHANNEL_SINGLE_TO-220AB  [TO-220AB]
SOL_4  IRL530PBF  MOSFET_N-CHANNEL_SINGLE_TO-220AB  [TO-220AB]
SOL_5  IRL530PBF  MOSFET_N-CHANNEL_SINGLE_TO-220AB  [TO-220AB]
SOL_6  IRL530PBF  MOSFET_N-CHANNEL_SINGLE_TO-220AB  [TO-220AB]
SOL_7  IRL530PBF  MOSFET_N-CHANNEL_SINGLE_TO-220AB  [TO-220AB]
SOL_8  IRL530PBF  MOSFET_N-CHANNEL_SINGLE_TO-220AB  [TO-220AB]
SOL_9  IRL530PBF  MOSFET_N-CHANNEL_SINGLE_TO-220AB  [TO-220AB]
SOL_10  IRL530PBF  MOSFET_N-CHANNEL_SINGLE_TO-220AB  [TO-220AB]
SOL_11  IRL530PBF  MOSFET_N-CHANNEL_SINGLE_TO-220AB  [TO-220AB]
SOL_12  IRL530PBF  MOSFET_N-CHANNEL_SINGLE_TO-220AB  [TO-220AB]
SOL_13  IRL530PBF  MOSFET_N-CHANNEL_SINGLE_TO-220AB  [TO-220AB]
SOL_14  IRL530PBF  MOSFET_N-CHANNEL_SINGLE_TO-220AB  [TO-220AB]
SOL_15  IRL530PBF  MOSFET_N-CHANNEL_SINGLE_TO-220AB  [TO-220AB]
SOL_16  IRL530PBF  MOSFET_N-CHANNEL_SINGLE_TO-220AB  [TO-220AB]
SOL_17  IRL530PBF  MOSFET_N-CHANNEL_SINGLE_TO-220AB  [TO-220AB]
SOL_18  IRL530PBF  MOSFET_N-CHANNEL_SINGLE_TO-220AB  [TO-220AB]
SOL_19  IRL530PBF  MOSFET_N-CHANNEL_SINGLE_TO-220AB  [TO-220AB]
SOL_20  IRL530PBF  MOSFET_N-CHANNEL_SINGLE_TO-220AB  [TO-220AB]
SOL_21  IRL530PBF  MOSFET_N-CHANNEL_SINGLE_TO-220AB  [TO-220AB]
SOL_22  IRL530PBF  MOSFET_N-CHANNEL_SINGLE_TO-220AB  [TO-220AB]
SOL_23  IRL530PBF  MOSFET_N-CHANNEL_SINGLE_TO-220AB  [TO-220AB]
SOL_BANK_0  26-64-4100  CON_01X09_26-64-4100_(KEYPIN6)  [26-64-4100(KEYPIN6)]
SOL_BANK_1  26-64-4100  CON_01X09_26-64-4100_(KEYPIN7)  [26-64-4100(KEYPIN7)]
SOL_BANK_2  26-64-4100  CON_01X09_26-64-4100_(KEYPIN8)  [26-64-4100(KEYPIN8)]
SOL_GND  TEST_POINT_SINGLE_ROUND_100MIL  [100MIL_TP]
SOL_PWR_0  TEST_POINT_SINGLE_ROUND_100MIL  [100MIL_TP]
SOL_PWR_1  TEST_POINT_SINGLE_ROUND_100MIL  [100MIL_TP]
SOL_PWR_2  TEST_POINT_SINGLE_ROUND_100MIL  [100MIL_TP]
SOL_PWR_3  TEST_POINT_SINGLE_ROUND_100MIL  [100MIL_TP]
SOL_PWR_4  TEST_POINT_SINGLE_ROUND_100MIL  [100MIL_TP]
SOL_PWR_5  TEST_POINT_SINGLE_ROUND_100MIL  [100MIL_TP]
SOL_PWR_6  TEST_POINT_SINGLE_ROUND_100MIL  [100MIL_TP]
SOL_PWR_7  TEST_POINT_SINGLE_ROUND_100MIL  [100MIL_TP]
SOL_PWR_8  TEST_POINT_SINGLE_ROUND_100MIL  [100MIL_TP]
SOL_PWR_9  TEST_POINT_SINGLE_ROUND_100MIL  [100MIL_TP]
SOL_PWR_10  TEST_POINT_SINGLE_ROUND_100MIL  [100MIL_TP]
SOL_PWR_11  TEST_POINT_SINGLE_ROUND_100MIL  [100MIL_TP]
SOL_PWR_12  TEST_POINT_SINGLE_ROUND_100MIL  [100MIL_TP]
SOL_PWR_13  TEST_POINT_SINGLE_ROUND_100MIL  [100MIL_TP]
SOL_PWR_14  TEST_POINT_SINGLE_ROUND_100MIL  [100MIL_TP]
SOL_PWR_15  TEST_POINT_SINGLE_ROUND_100MIL  [100MIL_TP]
SOL_PWR_16  TEST_POINT_SINGLE_ROUND_100MIL  [100MIL_TP]
SOL_PWR_17  TEST_POINT_SINGLE_ROUND_100MIL  [100MIL_TP]
SOL_PWR_18  TEST_POINT_SINGLE_ROUND_100MIL  [100MIL_TP]
SOL_PWR_19  TEST_POINT_SINGLE_ROUND_100MIL  [100MIL_TP]
SOL_PWR_20  TEST_POINT_SINGLE_ROUND_100MIL  [100MIL_TP]
SOL_PWR_21  TEST_POINT_SINGLE_ROUND_100MIL  [100MIL_TP]
SOL_PWR_22  TEST_POINT_SINGLE_ROUND_100MIL  [100MIL_TP]
SOL_PWR_23  TEST_POINT_SINGLE_ROUND_100MIL  [100MIL_TP]
SOLENOID_POWER_IN  26-64-4040  CON_01X03_26-64-4040_(KEYPIN3)  [26-64-4040(KEYPIN3)]
ST_BU_OUT  TEST_POINT_SINGLE_ROUND_100MIL  [100MIL_TP]
ST_LI  NDP6020P  BJT_PNP_SINGLE_TO-220  [TO-220AB]
ST_LI_  TEST_POINT_SINGLE_ROUND_100MIL  [100MIL_TP]
SW_C_0  TEST_POINT_SINGLE_ROUND_100MIL  [100MIL_TP]
SW_C_1  TEST_POINT_SINGLE_ROUND_100MIL  [100MIL_TP]
SW_C_2  TEST_POINT_SINGLE_ROUND_100MIL  [100MIL_TP]
SW_C_3  TEST_POINT_SINGLE_ROUND_100MIL  [100MIL_TP]
SW_C_4  TEST_POINT_SINGLE_ROUND_100MIL  [100MIL_TP]
SW_C_5  TEST_POINT_SINGLE_ROUND_100MIL  [100MIL_TP]
SW_C_6  TEST_POINT_SINGLE_ROUND_100MIL  [100MIL_TP]
SW_C_7  TEST_POINT_SINGLE_ROUND_100MIL  [100MIL_TP]
SW_COL  26-64-4100  CON_01X09_26-64-4100_(KEYPIN5)  [26-64-4100(KEYPIN5)]
SW_R_0  TEST_POINT_SINGLE_ROUND_100MIL  [100MIL_TP]
SW_R_1  TEST_POINT_SINGLE_ROUND_100MIL  [100MIL_TP]
SW_R_2  TEST_POINT_SINGLE_ROUND_100MIL  [100MIL_TP]
SW_R_3  TEST_POINT_SINGLE_ROUND_100MIL  [100MIL_TP]
SW_R_4  TEST_POINT_SINGLE_ROUND_100MIL  [100MIL_TP]
SW_R_5  TEST_POINT_SINGLE_ROUND_100MIL  [100MIL_TP]
SW_R_6  TEST_POINT_SINGLE_ROUND_100MIL  [100MIL_TP]
SW_R_7  TEST_POINT_SINGLE_ROUND_100MIL  [100MIL_TP]
SW_ROW  26-64-4100  CON_01X09_26-64-4100_(KEYPIN4)  [26-64-4100(KEYPIN4)]
SYM1  HIGH_VOLTAGE_500MIL  PCB_SYMBOL_HIGH_VOLTAGE_500MIL  [HIGH_VOLTAGE_500MIL]
TILT_OUT  TEST_POINT_SINGLE_ROUND_100MIL  [100MIL_TP]
U1  P8X32A-Q44  [P8X32A_LQFP-44]
U2  DS1340Z-33+  [DS1340Z_SOIC-8]
U3  CD74HC595M96  [CD74HC595_SOIC-16]
U4  CAT24M01LI-G  EEPROM_I2CDIP-8  [DIP-8]
U5  CD74HC595M96  [CD74HC595_SOIC-16]
U6  TPS259251  TPS2592(50/51/60/61)_VSON-10  [TPS2592(50/51/60/61)_VSON-10]
U7  TPS259261  TPS2592(50/51/60/61)_VSON-10  [TPS2592(50/51/60/61)_VSON-10]
U8  MF-DSC-SOT233-MMBT3904  NPN_BJT_SOT-23-3  [SOT-23-3]
U10  74HCT2G04GV,125  [74HCT2G04_TTSOP-6]
U11  74HC165D-Q100,118  CD74HC165M96  [CD74HC165_SOIC-16]
U12  74HC165D-Q100,118  CD74HC165M96  [CD74HC165_SOIC-16]
U13  CAT24M01LI-G  EEPROM_I2CDIP-8  [DIP-8]
U14  MC74HC08ADR2G  MC74HC08AD  [MC74HC08_SOIC-14]
U15  MC74HC08ADR2G  MC74HC08AD  [MC74HC08_SOIC-14]
U16  MC74HC08ADR2G  MC74HC08AD  [MC74HC08_SOIC-14]
U17  MC74HC08ADR2G  MC74HC08AD  [MC74HC08_SOIC-14]
U18  MC74HC08ADR2G  MC74HC08AD  [MC74HC08_SOIC-14]
U19  MC74HC08ADR2G  MC74HC08AD  [MC74HC08_SOIC-14]
U20  TIP107  BJT_PNP_SINGLE_TO-220  [TO-220AB]
U21  TIP107  BJT_PNP_SINGLE_TO-220  [TO-220AB]
U22  TIP107  BJT_PNP_SINGLE_TO-220  [TO-220AB]
U23  TIP107  BJT_PNP_SINGLE_TO-220  [TO-220AB]
U24  TIP107  BJT_PNP_SINGLE_TO-220  [TO-220AB]
U25  TIP107  BJT_PNP_SINGLE_TO-220  [TO-220AB]
U26  TIP107  BJT_PNP_SINGLE_TO-220  [TO-220AB]
U27  TIP107  BJT_PNP_SINGLE_TO-220  [TO-220AB]
U28  TIP102  BJT_NPN_SINGLE_TO-220  [TO-220AB]
U29  TIP102  BJT_NPN_SINGLE_TO-220  [TO-220AB]
U30  TIP102  BJT_NPN_SINGLE_TO-220  [TO-220AB]
U31  TIP102  BJT_NPN_SINGLE_TO-220  [TO-220AB]
U32  TIP102  BJT_NPN_SINGLE_TO-220  [TO-220AB]
U33  TIP102  BJT_NPN_SINGLE_TO-220  [TO-220AB]
U34  TIP102  BJT_NPN_SINGLE_TO-220  [TO-220AB]
U35  TIP102  BJT_NPN_SINGLE_TO-220  [TO-220AB]
U36  WS2801  WS2801SO  [WS2801_SOP-14]
U38  WS2801  WS2801SO  [WS2801_SOP-14]
U39  NCP1117DT33G  LINEAR_VOTLAGE_REGULATORS_NCP1117DT  [NCP1117DT_DPAK-3]
U52  CD74HC123M96  [CD74HC123_SOIC-16]
U$1  LHE_LOGOLHE_LOGO  [LHE_LOGO]
U$2  MF_LOGOLOGO_TEXT  [MF_LOGO_TEXT]
USB_PROG  N/A  CON_01X04_2.54MM_PIN_HEADER  [2.54MM_01X04_PIN_HEADER]
USER_0_OUT  TEST_POINT_SINGLE_ROUND_100MIL  [100MIL_TP]
WD  LG R971-KN-1  LED_SINGLE_0805  [LED_0805]
X1  FQ7050B-8.000  XTAL-FQ7050B  [FQ7050B]
X2  9C-6.500MAAJ-T  CRYSTAL_HC-49  [HC-49/US_SM]
X3  ABS25-32.768KHz-1-T  CRYSTAL_8MM_X_3.8MM  [8MM_X_3.8MM]

## Nets
3.3V: 3.3V.P$1 AUX_PWR.4 C2.1 C3.1 C4.1 C5.1 C6.1 C7.1 C11.1 C12.2 C15.P$1 C18.P$1 C20.2 C21.2 C22.2 C23.2 C24.2 C28.2 C31.2 C32.2 C33.2 C34.POS C35.1 C36.1 C37.1 C46.2 C47.2 C49.POS C54.2 C55.2 C56.1 C57.1 D1.2(AN) IC2.2(MISC:VDD) IC2.16(MISC:VDD) IC2.37(MISC:VDD) IC2.46(MISC:VDD) IC2.55(MISC:VUSB) IC2.62(MISC:VDD) IC2.86(MISC:VDD) IC3.20(P:VCC) IC4.20(P:VCC) OPTO_1.2 OPTO_2.2 OPTO_3.2 OPTO_4.2 OPTO_5.2 OPTO_6.2 OPTO_7.2 PHABULOUS.2 PICKIT3.2 PICKIT3_TC.P$2(PIN2) PSU_PWR.ANODE R1.2 R3.1 R4.2 R16.2 R17.2 R18.1 R19.1 R20.1 R21.1 R22.1 R23.1 R24.2 R25.2 R35.2 R36.2 R37.2 R38.2 R39.2 R40.2 R41.2 R42.2 R43.2 R44.2 R45.2 R46.2 R47.2 R48.2 R49.2 R50.2 R75.1 R76.1 R77.1 R78.1 R79.2 R80.2 R81.2 R82.2 R119.2 R120.2 R121.2 R122.2 R123.2 R124.2 R137.2 R176.2 SD0.4(3.3V) U1.8(VDD) U1.18(VDD) U1.30(VDD) U1.40(VDD) U2.8(VCC) U4.8(VCC) U11.16(VCC) U12.16(VCC) U13.8(VCC) U36.14(VDD) U38.14(VDD) U39.TAB(OUT)
5V: AUX_PWR.3 C16.P$1 C19.P$1 C25.2 C26.2 C30.1 C38.1 C39.1 C40.1 C41.1 C42.1 C48.1 C50.POS C51.1 C52.1 C53.1 C62.1 C63.1 C64.1 C65.1 CABINET_I/O.P$2 D2.1(CATHODE) DMD_PWR.3(PIN2) F4.P$1 F5.P$1 F6.P$1 PHABULOUS.3 R115.1 R134.2 R139.1 R140.1 R141.1 R142.1 R143.1 R144.1 R145.1 RGB_COM_OUT.P$7 ST_LI.S(EMITTER) U3.10(MR) U3.16(VCC) U5.10(MR) U5.16(VCC) U6.P$6(OUT) U6.P$7(OUT) U6.P$8(OUT) U10.5(VCC) U14.14(VCC) U15.14(VCC) U16.14(VCC) U17.14(VCC) U18.14(VCC) U19.14(VCC) U39.3(IN) U52.2(!1B) U52.3(!1R) U52.16(VCC)
5V_IN: 5V.P$1 BOARD_POWER_IN.1(PIN1) C58.1 D3.CATH(CATHODE) R147.1 U6.P$3(VIN) U6.P$4(VIN) U6.P$5(VIN)
12V: AUX_PWR.2 C17.P$1 C29.P$1 C43.1 C44.1 C45.1 CAB_RGB.P$3 CAB_RGB.P$7 DMD_PWR.2(PIN1) F7.P$1 PHABULOUS.7 R83.1 R85.1 R87.1 R89.1 R91.1 R93.1 R95.1 R97.1 RGB_COM_OUT.P$6 U7.P$6(OUT) U7.P$7(OUT) U7.P$8(OUT) U20.S(EMITTER) U21.S(EMITTER) U22.S(EMITTER) U23.S(EMITTER) U24.S(EMITTER) U25.S(EMITTER) U26.S(EMITTER) U27.S(EMITTER)
12V_IN: 12V.P$1 BOARD_POWER_IN.3(PIN2) C60.1 D4.CATH(CATHODE) R158.1 U7.P$3(VIN) U7.P$4(VIN) U7.P$5(VIN)
50V: 50V.P$1 F1.P$1 F2.P$1 F3.P$1 SOLENOID_POWER_IN.4(PIN3)
50V_FUSE_0: D9.ANODE F1.P$2 KNOCKER.P$1(PIN1) SHAKER.P$1(PIN1) SOL_BANK_0.P$1(PIN1)
50V_FUSE_1: D10.ANODE F2.P$2 SOL_BANK_1.P$1(PIN1)
50V_FUSE_2: D11.ANODE F3.P$2 SOL_BANK_2.P$1(PIN1)
!DATA_LAT: U3.12(STCP) U5.12(STCP) U10.6(1Y)
AUD0: R32.1 U1.16(P15)
AUD1: R34.1 U1.15(P14)
AUX_0: R35.1 R138.1 U11.11(D0)
AUX_1: R31.1 R36.1 U11.12(D1)
AUX_2: R28.1 R37.1 U11.13(D2)
AUX_3: R15.1 R39.1 U11.3(D4)
AUX_4: R10.1 R40.1 U11.4(D5)
AUX_5: R7.1 R41.1 U11.5(D6)
AUX_6: R5.1 R42.1 U11.6(D7)
AVCC: C8.1 C9.1 IC2.30(MISC:AVDD) R3.2
BACK: R47.1 R152.2 U12.3(D4)
BACK_OUT: BACK_OUT.P$1 CABINET_I/O.P$8 R152.1
BKUP_V: BATT1.POS(+) U2.3(V_BACK)
CAB_CLK: IC2.93(PE:PMD0/RE0) U3.11(SHCP) U5.11(SHCP) U11.2(CLK) U12.2(CLK)
CAB_GI_OUT: IC2.11(PG:ECRS/SDA2A/SDI2A/U2ARX/PMA4/CN9/RG7) U3.14(DS)
CAB_LAT: IC2.12(PG:SCL2A/SDO2A/U2ATX/PMA3/CN10/RG8) U10.1(1A) U11.1(LAT) U12.1(LAT)
CAB_SWITCH_IN: IC2.87(PF:C1RX/ETXD1/PMD11/RF0) U11.9(QH)
COIN: R49.1 R150.2 U12.5(D6)
COIN_OUT: CABINET_I/O.P$6 COIN_OUT.P$1 R150.1
COMM_CLK_RX: IC2.40(PF:AC1RX/SS3A/U3BRX/U3ACTS/RF12) U1.32(P25)
COMM_IN_TX: IC2.39(PF:AC1TX/SCK3A/U3BTX/U3ARTS/RF13) U1.31(P24)
COMM_OUT: IC2.50(PF:SCL3A/SDO3A/U3ATX/PMA8/CN18/RF5) U1.33(P26)
DATA_CAB1: U11.10(SER) U12.9(QH)
DMD_1: DMD_1.P$1 DMD_CON.1(PIN1) U1.25(P22)
DMD_3: DMD_3.P$1 DMD_CON.3(PIN3) U1.24(P21)
DMD_5: DMD_5.P$1 DMD_CON.5(PIN5) U1.23(P20)
DMD_7: DMD_7.P$1 DMD_CON.7(PIN7) U1.22(P19)
DMD_9: DMD_9.P$1 DMD_CON.9(PIN9) U1.21(P18)
DMD_11: DMD_11.P$1 DMD_CON.11(PIN11) U1.20(P17)
DMD_13: DMD_13.P$1 DMD_CON.13(PIN13) U1.19(P16)
DOOR: R43.1 R153.2 U12.11(D0)
DOOR_OUT: CABINET_I/O.P$9 DOOR_OUT.P$1 R153.1
ENTER: R48.1 R151.2 U12.4(D5)
ENTER_OUT: CABINET_I/O.P$7 ENTER_OUT.P$1 R151.1
EXT_RGB_CLK: EXT_RGB_CLK.P$1 IC2.6(PC:T2CK/RC1) RGB_COM_OUT.P$5
EXT_RGB_DATA: EXT_RGB_DATA.P$1 IC2.10(PG:ECOL/SCK2A/U2BTXU2ARTS/PMA5/CN8/RG6) RGB_COM_OUT.P$4
FLASH_12V: D6.ANODE F7.P$2 FLASHER.P$1(PIN1)
GI0_5V: D7.ANODE F5.P$2 GI_0.P$10(PIN9)
GI1_5V: D8.ANODE F4.P$2 GI_1.P$9(PIN9)
GI15: GI15.D(COLLECTOR) GI15_.P$1 GI_1.P$8(PIN8)
GI_0: R99.1 U3.15(Q0)
GI_1: R101.1 U3.1(Q1)
GI_2: R103.1 U3.2(Q2)
GI_3: R105.1 U3.3(Q3)
GI_4: R107.1 U3.4(Q4)
GI_5: R109.1 U3.5(Q5)
GI_6: R111.1 U3.6(Q6)
GI_7: R113.1 U3.7(Q7)
GI_8: R125.1 U5.15(Q0)
GI_9: R126.1 U5.1(Q1)
GI_10: R127.1 U5.2(Q2)
GI_11: R128.1 U5.3(Q3)
GI_12: R129.1 U5.4(Q4)
GI_13: R130.1 U5.5(Q5)
GI_14: R131.1 U5.6(Q6)
GI_15: R132.1 U5.7(Q7)
GI_DATA_COL_B: U3.9(Q7S) U5.14(DS)
GI_R_0: GI0.D(COLLECTOR) GI_0.P$1(PIN1) GI_R_0.P$1
GI_R_1: GI1.D(COLLECTOR) GI_0.P$2(PIN2) GI_R_1.P$1
GI_R_2: GI2.D(COLLECTOR) GI_0.P$3(PIN3) GI_R_2.P$1
GI_R_3: GI3.D(COLLECTOR) GI_0.P$4(PIN4) GI_R_3.P$1
GI_R_4: GI4.D(COLLECTOR) GI_0.P$5(PIN5) GI_R_4.P$1
GI_R_5: GI5.D(COLLECTOR) GI_0.P$6(PIN6) GI_R_5.P$1
GI_R_6: GI6.D(COLLECTOR) GI_0.P$7(PIN7) GI_R_6.P$1
GI_R_7: GI7.D(COLLECTOR) GI_0.P$8(PIN8) GI_R_7.P$1
GI_R_8: GI8.D(COLLECTOR) GI_1.P$1(PIN1) GI_R_8.P$1
GI_R_9: GI9.D(COLLECTOR) GI_1.P$2(PIN2) GI_R_9.P$1
GI_R_10: GI10.D(COLLECTOR) GI_1.P$3(PIN3) GI_R_10.P$1
GI_R_11: GI11.D(COLLECTOR) GI_1.P$4(PIN4) GI_R_11.P$1
GI_R_12: GI12.D(COLLECTOR) GI_1.P$5(PIN5) GI_R_12.P$1
GI_R_13: GI13.D(COLLECTOR) GI_1.P$6(PIN6) GI_R_13.P$1
GI_R_14: GI14.D(COLLECTOR) GI_1.P$7(PIN7) GI_R_14.P$1
GND: AUDIO.1_A(S) AUDIO.1_B(S) AUDIO.S1(SHIELD) AUDIO.S2(SHIELD) AUDIO.S3(SHIELD) AUDIO.S4(SHIELD) AUDIO.S5(SHIELD) AUDIO.S6(SHIELD) AUX_PWR.1 BATT1.NEG(-) BOARD_POWER_IN.4(PIN3) C2.2 C3.2 C4.2 C5.2 C6.2 C7.2 C8.2 C9.2 C10.2 C11.2 C12.1 C13.2 C14.2 C15.P$2 C16.P$2 C17.P$2 C18.P$2 C19.P$2 C20.1 C21.1 C22.1 C23.1 C24.1 C25.1 C26.1 C27.NEG C28.1 C29.P$2 C30.2 C31.1 C32.1 C33.1 C34.NEG C35.2 C36.2 C37.2 C38.2 C39.2 C40.2 C41.2 C42.2 C43.2 C44.2 C45.2 C46.1 C47.1 C48.2 C49.NEG C50.NEG C51.2 C52.2 C53.2 C54.1 C55.1 C56.2 C57.2 C58.2 C59.2 C60.2 C61.2 C62.2 C63.2 C64.2 C65.2 CABINET_I/O.P$1 D1.1(CAT) D3.ANODE D4.ANODE DMD_CON.2(PIN2) DMD_CON.4(PIN4) DMD_CON.6(PIN6) DMD_CON.8(PIN8) DMD_CON.10(PIN10) DMD_CON.12(PIN12) DMD_CON.14(PIN14) DMD_PWR.4(PIN3) FLASHER.P$2(PIN2) GI0.S(EMITTER) GI1.S(EMITTER) GI2.S(EMITTER) GI3.S(EMITTER) GI4.S(EMITTER) GI5.S(EMITTER) GI6.S(EMITTER) GI7.S(EMITTER) GI8.S(EMITTER) GI9.S(EMITTER) GI10.S(EMITTER) GI11.S(EMITTER) GI12.S(EMITTER) GI13.S(EMITTER) GI14.S(EMITTER) GI15.S(EMITTER) GND.P$1 IC2.15(MISC:VSS) IC2.31(MISC:AVSS) IC2.36(MISC:VSS) IC2.45(MISC:VSS) IC2.65(MISC:VSS) IC2.75(MISC:VSS) IC3.1(A:G) IC3.10(P:GND) IC3.19(B:G) IC4.1(A:G) IC4.10(P:GND) IC4.19(B:G) IC5.9(GND) OPTO_1.3 OPTO_2.3 OPTO_3.3 OPTO_4.3 OPTO_5.3 OPTO_6.3 OPTO_7.3 PHABULOUS.1 PHABULOUS.6 PHABULOUS.8 PHABULOUS.11 PIC32_TC.P$5(PIN5) PIC32_UART.1 PIC_PROGRAM.P$4 PIC_RESET.P$1 PICKIT3.3 PICKIT3_TC.P$3(PIN3) PROP_CONFIG.P$4 PROP_RESET.P$3 PROP_TC.P$5(PIN5) PROP_UART.1 R2.1 R6.1 R9.1 R11.1 R27.1 R29.1 R30.1 R33.1 R51.1 R52.1 R53.1 R54.1 R55.1 R56.1 R57.1 R58.1 R59.1 R60.1 R61.1 R62.1 R63.1 R64.1 R65.1 R66.1 R67.1 R68.1 R69.1 R70.1 R71.1 R72.1 R73.1 R74.1 R117.1 R118.2 R133.2 R135.2 R136.1 R146.2 R157.2 R159.2 R160.2 R161.2 R162.2 RGB_0.S(SOURCE) RGB_1.S(SOURCE) RGB_2.S(SOURCE) RGB_3.S(SOURCE) RGB_4.S(SOURCE) RGB_5.S(SOURCE) RGB_COM_OUT.P$1 SD0.3(GND) SD0.6(GND) SD0.GND_1(GND) SD0.GND_2(GND) SERVO_0.P$1(PIN1) SERVO_1.P$1(PIN1) SERVO_2.P$1(PIN1) SERVO_3.P$1(PIN1) SERVO_4.P$1(PIN1) U1.5(VSS) U1.6(!BOE) U1.17(VSS) U1.27(VSS) U1.39(VSS) U2.4(VSS) U3.8(GND) U3.13(OE) U4.2(A1) U4.3(A2) U4.4(GND) U4.7(WP) U5.8(GND) U5.13(OE) U6.P$9(GND) U6.PAD2(GND) U6.PAD3(GND) U6.PAD4(GND) U6.PAD5(GND) U6.PAD6(GND) U6.PAD7(GND) U6.PAD(GND) U7.P$9(GND) U7.PAD2(GND) U7.PAD3(GND) U7.PAD4(GND) U7.PAD5(GND) U7.PAD6(GND) U7.PAD7(GND) U7.PAD(GND) U8.P$2(EMITTER) U10.2(GND) U11.8(GND) U11.15(C_INH) U12.8(GND) U12.15(C_INH) U13.2(A1) U13.3(A2) U13.4(GND) U13.7(WP) U14.7(GND) U15.7(GND) U16.7(GND) U17.7(GND) U18.7(GND) U19.7(GND) U28.S(EMITTER) U29.S(EMITTER) U30.S(EMITTER) U31.S(EMITTER) U32.S(EMITTER) U33.S(EMITTER) U34.S(EMITTER) U35.S(EMITTER) U36.3(POL) U36.4(RFB) U36.5(GFB) U36.6(BFB) U36.7(GND) U38.3(POL) U38.4(RFB) U38.5(GFB) U38.6(BFB) U38.7(GND) U39.1(GND) U52.8(GND) U52.14(1CX) USB_PROG.4
I2C_SCL: IC2.66(PA:AETXCLK/SCL1/INT3/RA14) PHABULOUS.5 R24.1 U2.6(SCL) U13.6(SCL)
I2C_SDA: IC2.67(PA:AETXEN/SDA1/INT4/RA15) PHABULOUS.4 R25.1 U2.5(SDA) U13.5(SDA)
L_FLIP: R46.1 R156.2 U12.14(D3)
L_FLIP_OUT: CABINET_I/O.P$12 L_FLIP_OUT.P$1 R156.1
LIGHT_C_0: LIGHT_C_0.P$1 LIGHT_COL.P$3(PIN2) U20.D(COLLECTOR)
LIGHT_C_1: LIGHT_C_1.P$1 LIGHT_COL.P$4(PIN3) U21.D(COLLECTOR)
LIGHT_C_2: LIGHT_C_2.P$1 LIGHT_COL.P$5(PIN4) U22.D(COLLECTOR)
LIGHT_C_3: LIGHT_C_3.P$1 LIGHT_COL.P$6(PIN5) U23.D(COLLECTOR)
LIGHT_C_4: LIGHT_C_4.P$1 LIGHT_COL.P$7(PIN6) U24.D(COLLECTOR)
LIGHT_C_5: LIGHT_C_5.P$1 LIGHT_COL.P$8(PIN7) U25.D(COLLECTOR)
LIGHT_C_6: LIGHT_C_6.P$1 LIGHT_COL.P$9(PIN8) U26.D(COLLECTOR)
LIGHT_C_7: LIGHT_C_7.P$1 LIGHT_COL.P$10(PIN9) U27.D(COLLECTOR)
LIGHT_C_B_0: R83.2 R84.2 U20.G(BASE)
LIGHT_C_B_1: R85.2 R86.2 U21.G(BASE)
LIGHT_C_B_2: R87.2 R88.2 U22.G(BASE)
LIGHT_C_B_3: R89.2 R90.2 U23.G(BASE)
LIGHT_C_B_4: R91.2 R92.2 U24.G(BASE)
LIGHT_C_B_5: R93.2 R94.2 U25.G(BASE)
LIGHT_C_B_6: R95.2 R96.2 U26.G(BASE)
LIGHT_C_B_7: R97.2 R98.2 U27.G(BASE)
LIGHT_DTA_0: IC5.11(O8) R84.1
LIGHT_DTA_1: IC5.12(O7) R86.1
LIGHT_DTA_2: IC5.13(O6) R88.1
LIGHT_DTA_3: IC5.14(O5) R90.1
LIGHT_DTA_4: IC5.15(O4) R92.1
LIGHT_DTA_5: IC5.16(O3) R94.1
LIGHT_DTA_6: IC5.17(O2) R96.1
LIGHT_DTA_7: IC5.18(O1) R98.1
LIGHT_R_0: LIGHT_R_0.P$1 LIGHT_ROW.P$2(PIN2) U28.D(COLLECTOR)
LIGHT_R_1: LIGHT_R_1.P$1 LIGHT_ROW.P$4(PIN3) U29.D(COLLECTOR)
LIGHT_R_2: LIGHT_R_2.P$1 LIGHT_ROW.P$5(PIN4) U30.D(COLLECTOR)
LIGHT_R_3: LIGHT_R_3.P$1 LIGHT_ROW.P$6(PIN5) U31.D(COLLECTOR)
LIGHT_R_4: LIGHT_R_4.P$1 LIGHT_ROW.P$7(PIN6) U32.D(COLLECTOR)
LIGHT_R_5: LIGHT_R_5.P$1 LIGHT_ROW.P$8(PIN7) U33.D(COLLECTOR)
LIGHT_R_6: LIGHT_R_6.P$1 LIGHT_ROW.P$9(PIN8) U34.D(COLLECTOR)
LIGHT_R_7: LIGHT_R_7.P$1 LIGHT_ROW.P$10(PIN9) U35.D(COLLECTOR)
N$1: U2.2(X2) X3.4
N$2: U2.1(X1) X3.1
N$3: PROP_ACT.CATHODE R30.2
N$4: C1.1 PROP_TC.P$6(PIN6) PROP_UART.6
N$5: C10.1 IC2.85(MISC:VCAP/VDDCORE)
N$6: OPTO_6.4 R144.2
N$7: OPTO_5.4 R143.2
N$8: OPTO_1.4 R139.2
N$9: PIC_RESET.P$4 R8.1
N$10: OPTO_7.4 R145.2
N$11: OPTO_4.4 R142.2
N$12: OPTO_3.4 R141.2
N$13: R100.2 U28.G(BASE)
N$14: OPTO_2.4 R140.2
N$15: R102.2 U29.G(BASE)
N$16: R147.2 U6.P$2(EN/UVLO)
N$17: R158.2 U7.P$2(EN/UVLO)
N$18: D5.CATHODE R159.1
N$19: R23.2 SD0.9(RW)
N$20: PIC32_TC.P$6(PIN6) PIC32_UART.6 R26.1
N$21: R104.2 U30.G(BASE)
N$22: R119.1 RGB_0.G(GATE) U38.8(BOUT)
N$23: R120.1 RGB_1.G(GATE) U38.9(GOUT)
N$24: D6.CATHODE R160.1
N$25: R121.1 RGB_2.G(GATE) U38.10(ROUT)
N$26: R124.1 RGB_5.G(GATE) U36.10(ROUT)
N$27: D7.CATHODE R161.1
N$28: R123.1 RGB_4.G(GATE) U36.9(GOUT)
N$29: R122.1 RGB_3.G(GATE) U36.8(BOUT)
N$30: D8.CATHODE R162.1
N$31: PICKIT3.4 PICKIT3_TC.P$4(PIN4) R13.2
N$32: R116.1 U8.P$1(BASE)
N$33: PICKIT3.5 PICKIT3_TC.P$5(PIN5) R14.2
N$34: R106.2 U31.G(BASE)
N$37: C13.1 IC2.64(PC:OSC2/CLKO/RC15) X1.1
N$38: D1.3(COM) IC2.13(MISC:MCLR) R12.1
N$39: D9.CATHODE R163.1
N$40: R108.2 U32.G(BASE)
N$41: C14.1 IC2.63(PC:OSC1/CLKI/RC12) X1.3
N$42: D10.CATHODE R164.1
N$43: R110.2 U33.G(BASE)
N$44: PHABULOUS.20
N$45: R112.2 U34.G(BASE)
N$46: D11.CATHODE R165.1
N$47: R114.2 U35.G(BASE)
N$48: R146.1 U6.P$10(ILIM)
N$49: R115.2 ST_LI.G(BASE) U8.P$3(COLLECTOR)
N$50: R118.1 WD.CATHODE
N$51: PSU_PWR.CATHODE R117.2
N$52: C59.1 U6.P$1(DV/DT)
N$55: C61.1 U7.P$1(DV/DT)
N$59: R157.1 U7.P$10(ILIM)
N$481: GI0.G(BASE) R99.2
N$482: GI1.G(BASE) R101.2
N$483: GI2.G(BASE) R103.2
N$484: GI3.G(BASE) R105.2
N$485: GI4.G(BASE) R107.2
N$486: GI5.G(BASE) R109.2
N$487: GI6.G(BASE) R111.2
N$488: GI7.G(BASE) R113.2
N$489: GI8.G(BASE) R125.2
N$490: GI9.G(BASE) R126.2
N$491: GI10.G(BASE) R127.2
N$492: GI11.G(BASE) R128.2
N$493: GI12.G(BASE) R129.2
N$494: GI13.G(BASE) R130.2
N$495: GI14.G(BASE) R131.2
N$496: GI15.G(BASE) R132.2
OPTO_1: OPTO_1.1 OPTO_1_.P$1 R2.2 R5.2
OPTO_2: OPTO_2.1 OPTO_2_.P$1 R6.2 R7.2
OPTO_3: OPTO_3.1 OPTO_3_.P$1 R9.2 R10.2
OPTO_4: OPTO_4.1 OPTO_4_.P$1 R11.2 R15.2
OPTO_5: OPTO_5.1 OPTO_5_.P$1 R27.2 R28.2
OPTO_6: OPTO_6.1 OPTO_6_.P$1 R29.2 R31.2
OPTO_7: OPTO_7.1 OPTO_7_.P$1 R33.2 R138.2
P32_MCLR: PICKIT3.1 PICKIT3_TC.P$1(PIN1) R4.1 R8.2 R12.2 R26.2
PIC_ENABLE: IC2.1(PG:AERXERR/RG15) R133.1 U52.1(!1A)
PIC_LIGHT_C_0: IC2.25(PB:PGED1/AN0/CN2/RB0) IC5.8(I8)
PIC_LIGHT_C_1: IC2.24(PB:PGEC1/AN1/CN3/RB1) IC5.7(I7)
PIC_LIGHT_C_2: IC2.23(PB:AN2/C2IN-/CN4/RB2) IC5.6(I6)
PIC_LIGHT_C_3: IC2.22(PB:AN3/C2IN+/CN5/RB3) IC5.5(I5)
PIC_LIGHT_C_4: IC2.21(PB:AN4/C1IN-/CN6/RB4) IC5.4(I4)
PIC_LIGHT_C_5: IC2.20(PB:AN5/C1IN+/VBUSON/CN7/RB5) IC5.3(I3)
PIC_LIGHT_C_6: IC2.26(PB:PGEC2/AN6/OCFA/RB6) IC5.2(I2) R14.1
PIC_LIGHT_C_7: IC2.27(PB:PGED2/AN7/RB7) IC5.1(I1) R13.1
PIC_LIGHT_R_0: IC2.32(PB:AN8/C1OUT/RB8) R100.1
PIC_LIGHT_R_1: IC2.33(PB:AN9/C2OUT/RB9) R102.1
PIC_LIGHT_R_2: IC2.34(PB:AN10/CVREFOUT/PMA13/RB10) R104.1
PIC_LIGHT_R_3: IC2.35(PB:AN11/ERXERR/AETXERR/PMA12/RB11) R106.1
PIC_LIGHT_R_4: IC2.41(PB:AN12/ERXD0/AECRS/PMA11/RB12) R108.1
PIC_LIGHT_R_5: IC2.42(PB:AN13/ERXD1/AECOL/PMA10/RB13) R110.1
PIC_LIGHT_R_6: IC2.43(PB:AN14/ERXD2/AETXD3/PMALH/PMA1/RB14) R112.1
PIC_LIGHT_R_7: IC2.44(PB:OCFB/PMALL/PMA0/CN12/RB15) R114.1
PIC_PROGRAM_SW: IC2.14(PG:SS2A/U2BRX/U2ACTS/PMA2/CN11/RG9) PIC_PROGRAM.P$1 R137.1
PIC_SOL_0: IC2.7(PC:T3CK/AC2TX/RC2) R58.2 U14.2(B1)
PIC_SOL_1: IC2.8(PC:T4CK/AC2RX/RC3) R57.2 U14.5(B2)
PIC_SOL_2: IC2.3(PE:PMD5/RE5) R56.2 U14.10(B3)
PIC_SOL_3: IC2.51(PF:USBID/RF3) R55.2 U14.13(B4)
PIC_SOL_4: IC2.4(PE:PMD6/RE6) R54.2 U17.2(B1)
PIC_SOL_5: IC2.5(PE:PMD7/RE7) R53.2 U17.5(B2)
PIC_SOL_6: IC2.18(PE:AERXD0/INT1/RE8) R52.2 U17.10(B3)
PIC_SOL_7: IC2.74(PC:SOSCO/T1CK/CN0/RC14) R51.2 U17.13(B4)
PIC_SOL_8: IC2.19(PE:AERXD1/INT2/RE9) R66.2 U15.2(B1)
PIC_SOL_9: IC2.9(PC:T5CK/SDI1/RC4) R65.2 U15.5(B2)
PIC_SOL_10: IC2.58(PA:SCL2/RA2) R64.2 U15.10(B3)
PIC_SOL_11: IC2.17(PA:TMS/RA0) R63.2 U15.13(B4)
PIC_SOL_12: IC2.38(PA:TCK/RA1) R62.2 U18.2(B1)
PIC_SOL_13: IC2.60(PA:TDI/RA4) R61.2 U18.5(B2)
PIC_SOL_14: IC2.61(PA:TDO/RA5) R60.2 U18.10(B3)
PIC_SOL_15: IC2.73(PC:SOSCI/CN1/RC13) R59.2 U18.13(B4)
PIC_SOL_16: IC2.89(PG:C2TX/ETXERR/PMD9/RG1) R74.2 U16.2(B1)
PIC_SOL_17: IC2.90(PG:C2RX/PMD8/RG0) R73.2 U16.5(B2)
PIC_SOL_18: IC2.91(PA:TRCLK/RA6) R72.2 U16.10(B3)
PIC_SOL_19: IC2.92(PA:TRD3/RA7) R71.2 U16.13(B4)
PIC_SOL_20: IC2.95(PG:TRD2/RG14) R70.2 U19.2(B1)
PIC_SOL_21: IC2.96(PG:TRD1/RG12) R69.2 U19.5(B2)
PIC_SOL_22: IC2.97(PG:TRD0/RG13) R68.2 U19.10(B3)
PIC_SOL_23: IC2.28(PA:VREF-/CVREF-/AERXD2/PMA7/RA9) R67.2 U19.13(B4)
PIC_SW_C_0: IC2.68(PD:RTCC/EMDIO/AEMDIO/IC1/RD8) IC4.2(A:A1)
PIC_SW_C_1: IC2.69(PD:SS1/IC2/RD9) IC4.17(B:A4)
PIC_SW_C_2: IC2.70(PD:SCK1/IC3/PMCS2/PMA15/RD10) IC4.4(A:A2)
PIC_SW_C_3: IC2.71(PD:EMDC/AEMDC/IC4/PMCS1/PMA14/RD11) IC4.15(B:A3)
PIC_SW_C_4: IC2.79(PD:ETXD2/IC5/PMD12/RD12) IC4.6(A:A3)
PIC_SW_C_5: IC2.80(PD:ETXD3/PMD13/CN19/RD13) IC4.13(B:A2)
PIC_SW_C_6: IC2.47(PD:AETXD0/SS1A/U1BRX/U1ACTS/CN20/RD14) IC4.8(A:A4)
PIC_SW_C_7: IC2.48(PD:AETXD1/SCK1A/U1BTX/U1ARTS/CN21/RD15) IC4.11(B:A1)
PIC_SW_R_0: IC2.72(PD:SDO1/OC1/INT0/RD0) IC3.18(A:Y1)
PIC_SW_R_1: IC2.76(PD:OC2/RD1) IC3.3(B:Y4)
PIC_SW_R_2: IC2.77(PD:OC3/RD2) IC3.16(A:Y2)
PIC_SW_R_3: IC2.78(PD:OC4/RD3) IC3.5(B:Y3)
PIC_SW_R_4: IC2.81(PD:OC5/PMWR/CN13/RD4) IC3.14(A:Y3)
PIC_SW_R_5: IC2.82(PD:PMRD/CN14/RD5) IC3.7(B:Y2)
PIC_SW_R_6: IC2.83(PD:ETXEN/PMD14/CN15/RD6) IC3.12(A:Y4)
PIC_SW_R_7: IC2.84(PD:ETXCLK/PMD15/CN16/RD7) IC3.9(B:Y1)
PROP_ACT: PROP_ACT.ANODE U1.34(P27)
PROP_AUX0: PROP_AUX0.P$1 RGB_COM_OUT.P$3 U1.1(P4)
PROP_AUX1: PROP_AUX1.P$1 RGB_COM_OUT.P$2 U1.2(P5)
PROP_AUX2: PHABULOUS.12 U1.3(P6)
PROP_AUX3: PHABULOUS.13 U1.4(P7)
PROP_AUX4: PHABULOUS.14 U1.9(P8)
PROP_AUX5: PHABULOUS.15 U1.10(P9)
PROP_AUX6: PHABULOUS.16 U1.11(P10)
PROP_AUX7: PHABULOUS.17 U1.12(P11)
PROP_AUX8: PHABULOUS.18 U1.13(P12)
PROP_AUX9: PHABULOUS.19 U1.26(P23)
PROP_PROGRAM: PROP_CONFIG.P$1 R1.1 U1.14(P13)
R_FLIP: R45.1 R155.2 U12.13(D2)
R_FLIP_OUT: CABINET_I/O.P$11 R155.1 R_FLIP_OUT.P$1
RES: C1.2 PROP_RESET.P$2 R176.1 U1.7(!RES)
RGB_BOUT_L: CAB_RGB.P$4 RGB_0.D(DRAIN) RGB_BOUT_L.P$1
RGB_BOUT_R: CAB_RGB.P$8 RGB_3.D(DRAIN) RGB_BOUT_R.P$1
RGB_CLK: IC2.98(PE:PMD2/RE2) U38.1(CLI)
RGB_CLK_1: U36.1(CLI) U38.13(CKO)
RGB_CLK_OUT: U36.13(CKO)
RGB_DATA: IC2.94(PE:PMD1/RE1) U38.2(SDI)
RGB_DATA_1: U36.2(SDI) U38.12(SDO)
RGB_DATA_OUT: U36.12(SDO)
RGB_GOUT_L: CAB_RGB.P$5 RGB_1.D(DRAIN) RGB_GOUT_L.P$1
RGB_GOUT_R: CAB_RGB.P$9 RGB_4.D(DRAIN) RGB_GOUT_R.P$1
RGB_ROUT_L: CAB_RGB.P$6 RGB_2.D(DRAIN) RGB_ROUT_L.P$1
RGB_ROUT_R: CAB_RGB.P$10 RGB_5.D(DRAIN) RGB_ROUT_R.P$1
RX_PIC32: IC2.52(PF:SDA1A/SDI1A/U1ARX/RF2) PIC32_TC.P$4(PIN4) PIC32_UART.4
RX_PROP: PROP_TC.P$4(PIN4) PROP_UART.4 U1.38(P31)
S_L: AUDIO.2_A(T) AUDIO.2_B(T) R32.2 S_L.P$1
S_R: AUDIO.3_A(R) AUDIO.3_B(R) R34.2 S_R.P$1
SCL_PROP: R16.1 U1.35(P28) U4.6(SCL)
SD_CS: R22.2 SD0.1(CS) SD_CS.P$1 U1.44(P3)
SD_DI: R18.2 SD0.2(DI) SD_DI.P$1 U1.43(P2)
SD_DO: R20.2 SD0.7(D0) SD_DO.P$1 U1.41(P0)
SD_IQ: R21.2 SD0.8(IRQ)
SD_SCLK: R19.2 SD0.5(SCLK) SD_SCLK.P$1 U1.42(P1)
SDA_PROP: R17.1 U1.36(P29) U4.5(SDA)
SERVO_0: IC2.88(PF:C1TX/ETXD0/PMD10/RF1) SERVO_0.P$3(PIN3) SERVO_0_.P$1
SERVO_1: IC2.29(PA:VREF+/CVREF+/AERXD3/PMA6/RA10) SERVO_1.P$3(PIN3) SERVO_1_.P$1
SERVO_2: IC2.49(PF:SDA3A/SDI3A/U3ARX/PMA9/CN17/RF4) SERVO_2.P$3(PIN3) SERVO_2_.P$1
SERVO_3: IC2.99(PE:PMD3/RE3) PHABULOUS.9 SERVO_3.P$3(PIN3) SERVO_3_.P$1
SERVO_4: IC2.100(PE:PMD4/RE4) PHABULOUS.10 SERVO_4.P$3(PIN3) SERVO_4_.P$1
SERVO_5V: D5.ANODE F6.P$2 SERVO_0.P$2(PIN2) SERVO_1.P$2(PIN2) SERVO_2.P$2(PIN2) SERVO_3.P$2(PIN2) SERVO_4.P$2(PIN2)
SOL_0: SOL_0.G(GATE) U14.3(Y1)
SOL_1: SOL_1.G(GATE) U14.6(Y2)
SOL_2: SOL_2.G(GATE) U14.8(Y3)
SOL_3: SOL_3.G(GATE) U14.11(Y4)
SOL_4: SOL_4.G(GATE) U17.3(Y1)
SOL_5: SOL_5.G(GATE) U17.6(Y2)
SOL_6: SOL_6.G(GATE) U17.8(Y3)
SOL_7: SOL_7.G(GATE) U17.11(Y4)
SOL_8: SOL_8.G(GATE) U15.3(Y1)
SOL_9: SOL_9.G(GATE) U15.6(Y2)
SOL_10: SOL_10.G(GATE) U15.8(Y3)
SOL_11: SOL_11.G(GATE) U15.11(Y4)
SOL_12: SOL_12.G(GATE) U18.3(Y1)
SOL_13: SOL_13.G(GATE) U18.6(Y2)
SOL_14: SOL_14.G(GATE) U18.8(Y3)
SOL_15: SOL_15.G(GATE) U18.11(Y4)
SOL_16: SOL_16.G(GATE) U16.3(Y1)
SOL_17: SOL_17.G(GATE) U16.6(Y2)
SOL_18: SOL_18.G(GATE) U16.8(Y3)
SOL_19: SOL_19.G(GATE) U16.11(Y4)
SOL_20: SOL_20.G(GATE) U19.3(Y1)
SOL_21: SOL_21.G(GATE) U19.6(Y2)
SOL_22: SOL_22.G(GATE) U19.8(Y3)
SOL_23: SOL_23.G(GATE) U19.11(Y4)
SOL_GND: R136.2 R163.2 R164.2 R165.2 SOL_0.S(SOURCE) SOL_1.S(SOURCE) SOL_2.S(SOURCE) SOL_3.S(SOURCE) SOL_4.S(SOURCE) SOL_5.S(SOURCE) SOL_6.S(SOURCE) SOL_7.S(SOURCE) SOL_8.S(SOURCE) SOL_9.S(SOURCE) SOL_10.S(SOURCE) SOL_11.S(SOURCE) SOL_12.S(SOURCE) SOL_13.S(SOURCE) SOL_14.S(SOURCE) SOL_15.S(SOURCE) SOL_16.S(SOURCE) SOL_17.S(SOURCE) SOL_18.S(SOURCE) SOL_19.S(SOURCE) SOL_20.S(SOURCE) SOL_21.S(SOURCE) SOL_22.S(SOURCE) SOL_23.S(SOURCE) SOL_GND.P$1 SOLENOID_POWER_IN.1(PIN1) SOLENOID_POWER_IN.2(PIN2)
SOL_PWR_0: KNOCKER.P$2(PIN2) SOL_0.D(DRAIN) SOL_BANK_0.P$2(PIN2) SOL_PWR_0.P$1
SOL_PWR_1: SHAKER.P$2(PIN2) SOL_1.D(DRAIN) SOL_BANK_0.P$3(PIN3) SOL_PWR_1.P$1
SOL_PWR_2: SOL_2.D(DRAIN) SOL_BANK_0.P$4(PIN4) SOL_PWR_2.P$1
SOL_PWR_3: SOL_3.D(DRAIN) SOL_BANK_0.P$5(PIN5) SOL_PWR_3.P$1
SOL_PWR_4: SOL_4.D(DRAIN) SOL_BANK_0.P$7(PIN6) SOL_PWR_4.P$1
SOL_PWR_5: SOL_5.D(DRAIN) SOL_BANK_0.P$8(PIN7) SOL_PWR_5.P$1
SOL_PWR_6: SOL_6.D(DRAIN) SOL_BANK_0.P$9(PIN8) SOL_PWR_6.P$1
SOL_PWR_7: SOL_7.D(DRAIN) SOL_BANK_0.P$10(PIN9) SOL_PWR_7.P$1
SOL_PWR_8: SOL_8.D(DRAIN) SOL_BANK_1.P$2(PIN2) SOL_PWR_8.P$1
SOL_PWR_9: SOL_9.D(DRAIN) SOL_BANK_1.P$3(PIN3) SOL_PWR_9.P$1
SOL_PWR_10: SOL_10.D(DRAIN) SOL_BANK_1.P$4(PIN4) SOL_PWR_10.P$1
SOL_PWR_11: SOL_11.D(DRAIN) SOL_BANK_1.P$5(PIN5) SOL_PWR_11.P$1
SOL_PWR_12: SOL_12.D(DRAIN) SOL_BANK_1.P$6(PIN6) SOL_PWR_12.P$1
SOL_PWR_13: SOL_13.D(DRAIN) SOL_BANK_1.P$8(PIN7) SOL_PWR_13.P$1
SOL_PWR_14: SOL_14.D(DRAIN) SOL_BANK_1.P$9(PIN8) SOL_PWR_14.P$1
SOL_PWR_15: SOL_15.D(DRAIN) SOL_BANK_1.P$10(PIN9) SOL_PWR_15.P$1
SOL_PWR_16: SOL_16.D(DRAIN) SOL_BANK_2.P$2(PIN2) SOL_PWR_16.P$1
SOL_PWR_17: SOL_17.D(DRAIN) SOL_BANK_2.P$3(PIN3) SOL_PWR_17.P$1
SOL_PWR_18: SOL_18.D(DRAIN) SOL_BANK_2.P$4(PIN4) SOL_PWR_18.P$1
SOL_PWR_19: SOL_19.D(DRAIN) SOL_BANK_2.P$5(PIN5) SOL_PWR_19.P$1
SOL_PWR_20: SOL_20.D(DRAIN) SOL_BANK_2.P$6(PIN6) SOL_PWR_20.P$1
SOL_PWR_21: SOL_21.D(DRAIN) SOL_BANK_2.P$7(PIN7) SOL_PWR_21.P$1
SOL_PWR_22: SOL_22.D(DRAIN) SOL_BANK_2.P$9(PIN8) SOL_PWR_22.P$1
SOL_PWR_23: SOL_23.D(DRAIN) SOL_BANK_2.P$10(PIN9) SOL_PWR_23.P$1
ST_BU: R38.1 R148.2 U11.14(D3)
ST_BU_OUT: CABINET_I/O.P$4 R148.1 ST_BU_OUT.P$1
ST_LI: CABINET_I/O.P$3 ST_LI.D(COLLECTOR) ST_LI_.P$1
ST_LI_GATE: IC2.59(PA:SDA2/RA3) R116.2
SW_C_0: IC4.18(A:Y1) SW_C_0.P$1 SW_COL.P$10(PIN9)
SW_C_1: IC4.3(B:Y4) SW_C_1.P$1 SW_COL.P$9(PIN8)
SW_C_2: IC4.16(A:Y2) SW_C_2.P$1 SW_COL.P$8(PIN7)
SW_C_3: IC4.5(B:Y3) SW_C_3.P$1 SW_COL.P$7(PIN6)
SW_C_4: IC4.14(A:Y3) SW_C_4.P$1 SW_COL.P$6(PIN5)
SW_C_5: IC4.7(B:Y2) SW_C_5.P$1 SW_COL.P$4(PIN4)
SW_C_6: IC4.12(A:Y4) SW_C_6.P$1 SW_COL.P$3(PIN3)
SW_C_7: IC4.9(B:Y1) SW_C_7.P$1 SW_COL.P$2(PIN2)
SW_R_0: IC3.2(A:A1) R82.1 SW_R_0.P$1 SW_ROW.P$10(PIN9)
SW_R_1: IC3.17(B:A4) R81.1 SW_R_1.P$1 SW_ROW.P$9(PIN8)
SW_R_2: IC3.4(A:A2) R80.1 SW_R_2.P$1 SW_ROW.P$8(PIN7)
SW_R_3: IC3.15(B:A3) R79.1 SW_R_3.P$1 SW_ROW.P$7(PIN6)
SW_R_4: IC3.6(A:A3) R78.2 SW_R_4.P$1 SW_ROW.P$6(PIN5)
SW_R_5: IC3.13(B:A2) R77.2 SW_R_5.P$1 SW_ROW.P$5(PIN4)
SW_R_6: IC3.8(A:A4) R76.2 SW_R_6.P$1 SW_ROW.P$3(PIN3)
SW_R_7: IC3.11(B:A1) R75.2 SW_R_7.P$1 SW_ROW.P$2(PIN2)
TILT: R50.1 R149.2 U12.6(D7)
TILT_OUT: CABINET_I/O.P$5 R149.1 TILT_OUT.P$1
TX_PIC32: IC2.53(PF:SCL1A/SDO1A/U1ATX/RF8) PIC32_TC.P$3(PIN3) PIC32_UART.5
TX_PROP: PROP_TC.P$3(PIN3) PROP_UART.5 U1.37(P30)
USBD+: IC2.57(PG:D+/RG2) USB_PROG.3
USBD-: IC2.56(PG:D-/RG3) USB_PROG.2
USER_0: R44.1 R154.2 U12.12(D1)
USER_0_OUT: CABINET_I/O.P$10 R154.1 USER_0_OUT.P$1
VUSB: IC2.54(MISC:VBUS) USB_PROG.1
WATCHDOG: R135.1 U14.1(A1) U14.4(A2) U14.9(A3) U14.12(A4) U15.1(A1) U15.4(A2) U15.9(A3) U15.12(A4) U16.1(A1) U16.4(A2) U16.9(A3) U16.12(A4) U17.1(A1) U17.4(A2) U17.9(A3) U17.12(A4) U18.1(A1) U18.4(A2) U18.9(A3) U18.12(A4) U19.1(A1) U19.4(A2) U19.9(A3) U19.12(A4) U52.13(1Q) WD.ANODE
WATCHDOG_ADJUST: C27.POS D2.2(ANODE) R134.1 U52.15(1RXCX)
X0: U1.29(X0) X2.P$1
X1: U1.28(X1) X2.P$2
Unconnected: CAB_RGB.P$1 CAB_RGB.P$2 IC5.10(CD+) LIGHT_COL.P$1(PIN1) LIGHT_ROW.P$1(PIN1) PIC32_TC.P$1(PIN1) PIC32_TC.P$2(PIN2) PIC32_UART.2 PIC32_UART.3 PIC_PROGRAM.P$2 PIC_PROGRAM.P$3 PIC_RESET.P$2 PIC_RESET.P$3 PICKIT3.6 PICKIT3_TC.P$6(PIN6) PROP_CONFIG.P$2 PROP_CONFIG.P$3 PROP_RESET.P$1 PROP_RESET.P$4 PROP_TC.P$1(PIN1) PROP_TC.P$2(PIN2) PROP_UART.2 PROP_UART.3 SD0.CARD_DETECT(CD) SW_COL.P$1(PIN1) SW_ROW.P$1(PIN1) U2.7(FT/OUT) U4.1(A0) U5.9(Q7S) U10.3(2A) U10.4(2Y) U11.7(QH') U12.7(QH') U12.10(SER) U13.1(A0) U52.4(!1Q) U52.5(2Q) U52.6(2CX) U52.7(2RXCX) U52.9(!2A) U52.10(2B) U52.11(!2R) U52.12(!2Q)

## Notes on the sheet
- FQ7050B-8.000
- Reset